# EAGLE design main (EAGLE 9.6.2)
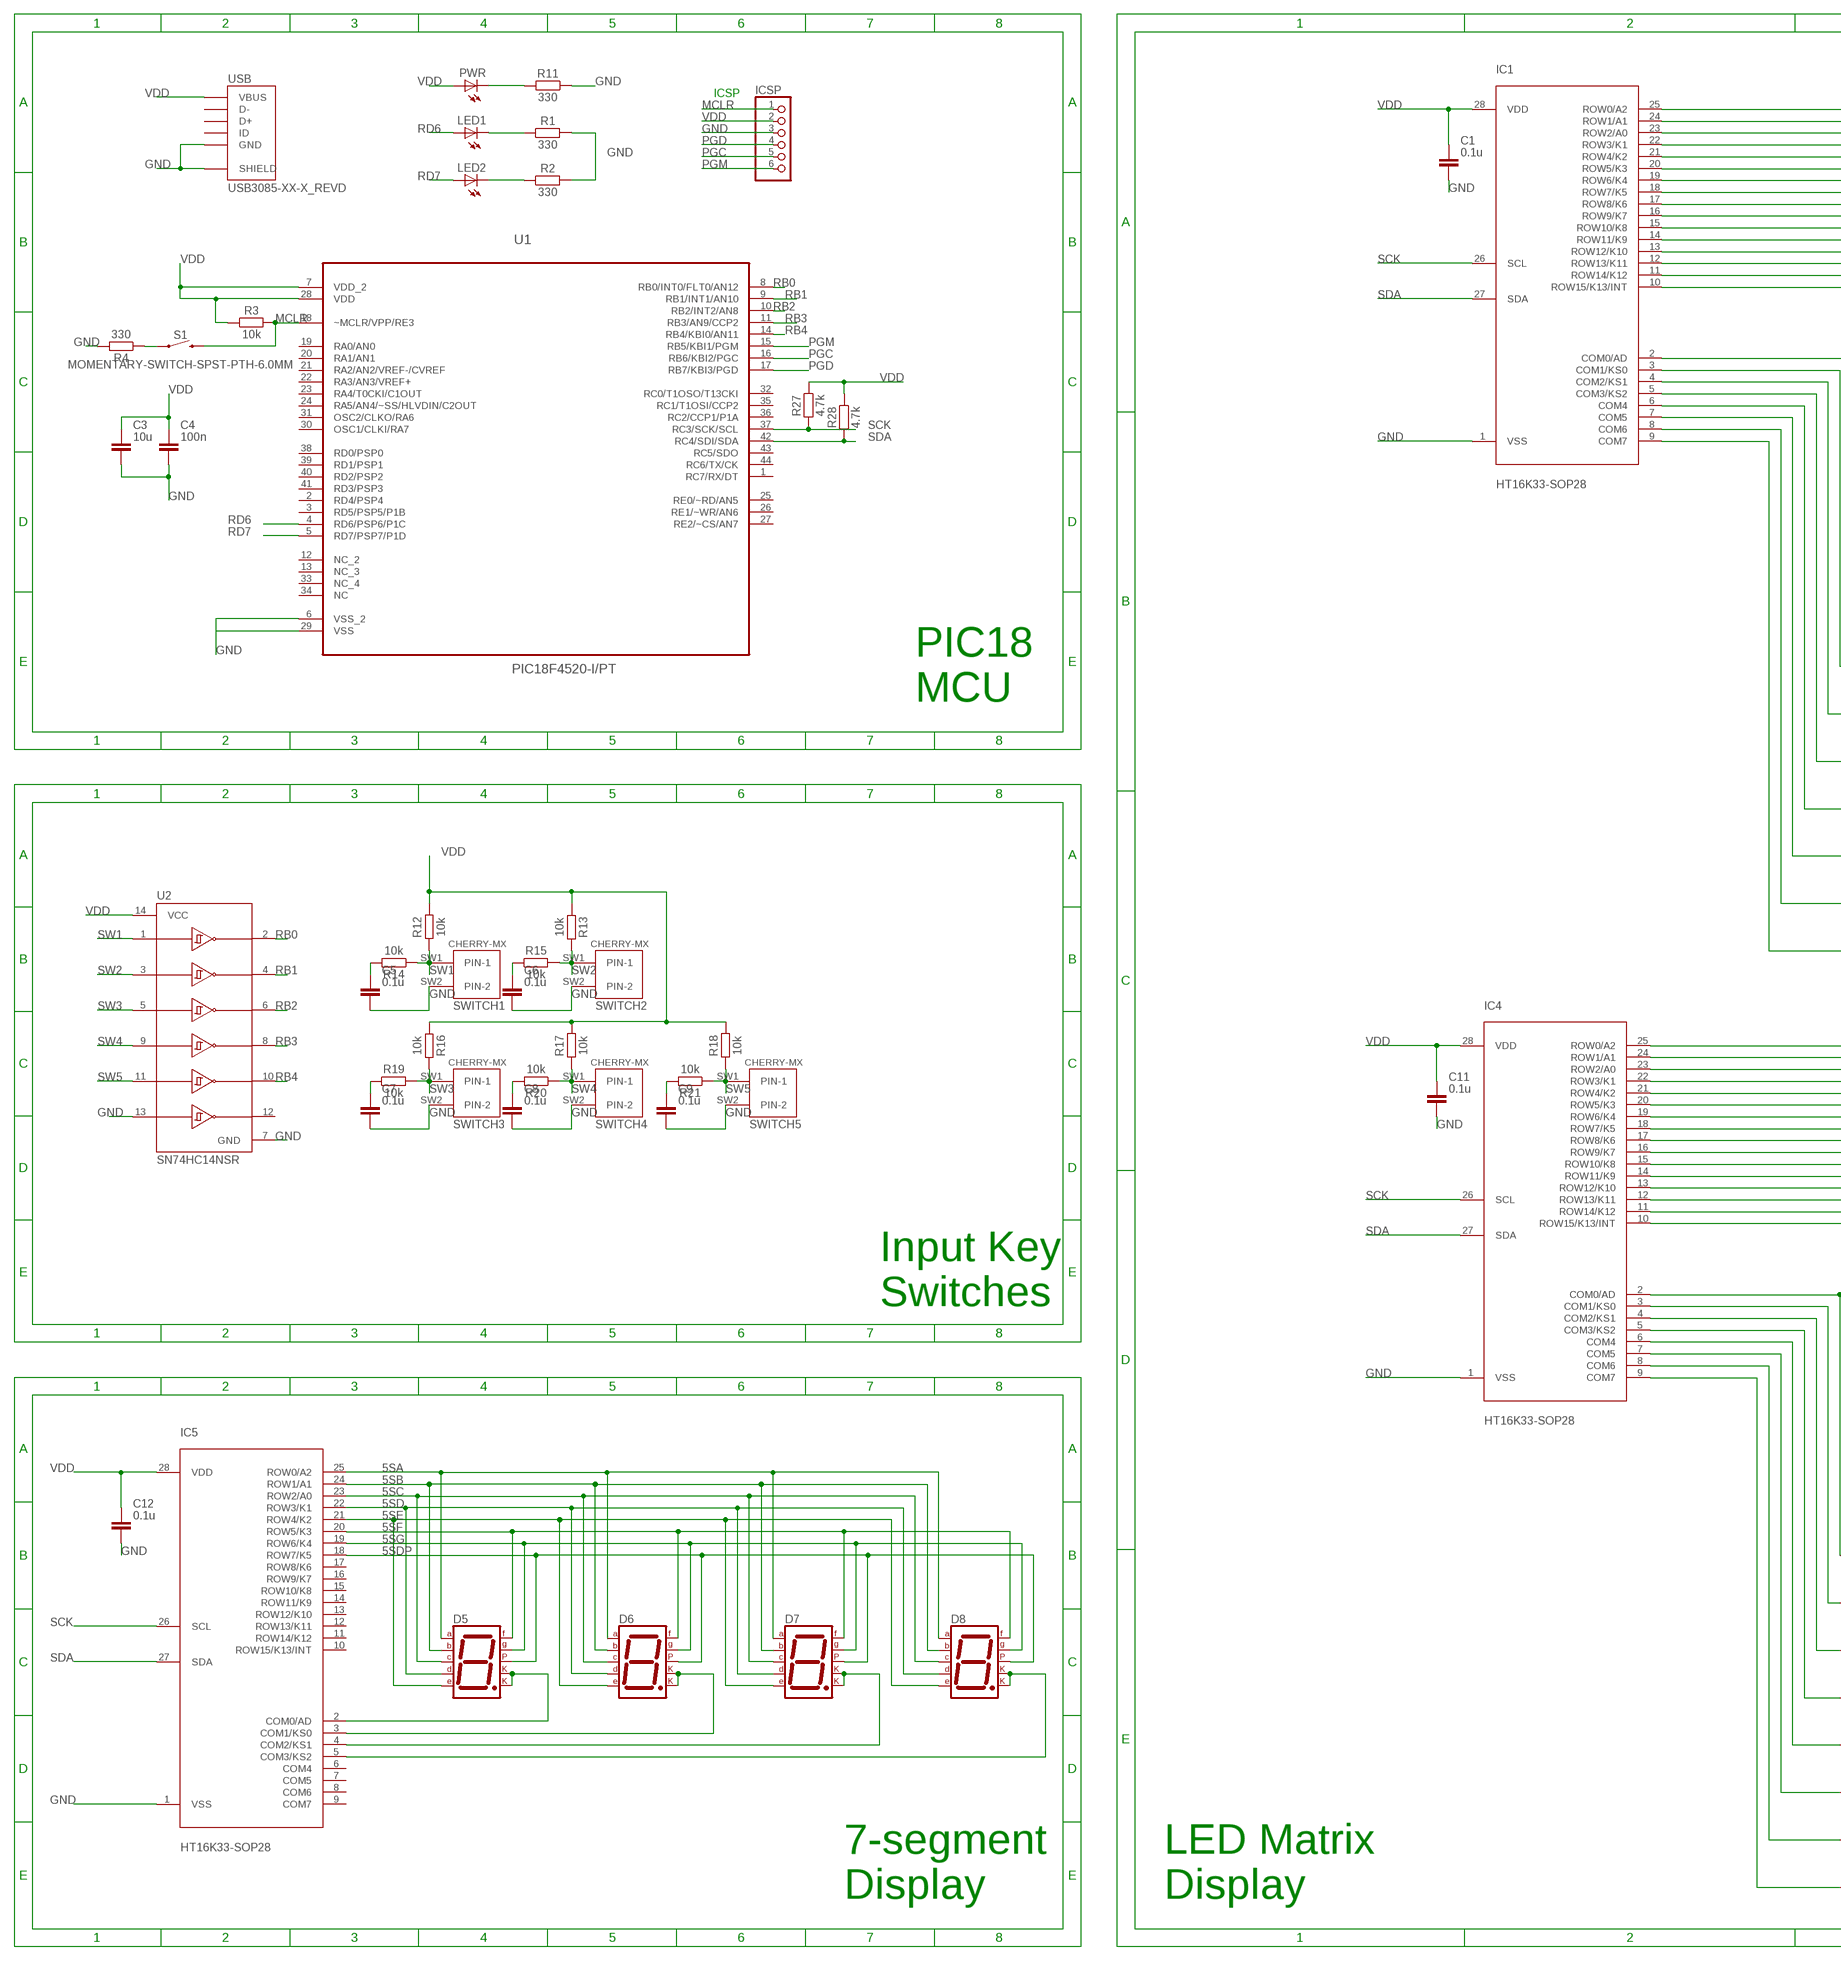
[diagram p0: schematic, sheet 1, part 1 of 2]
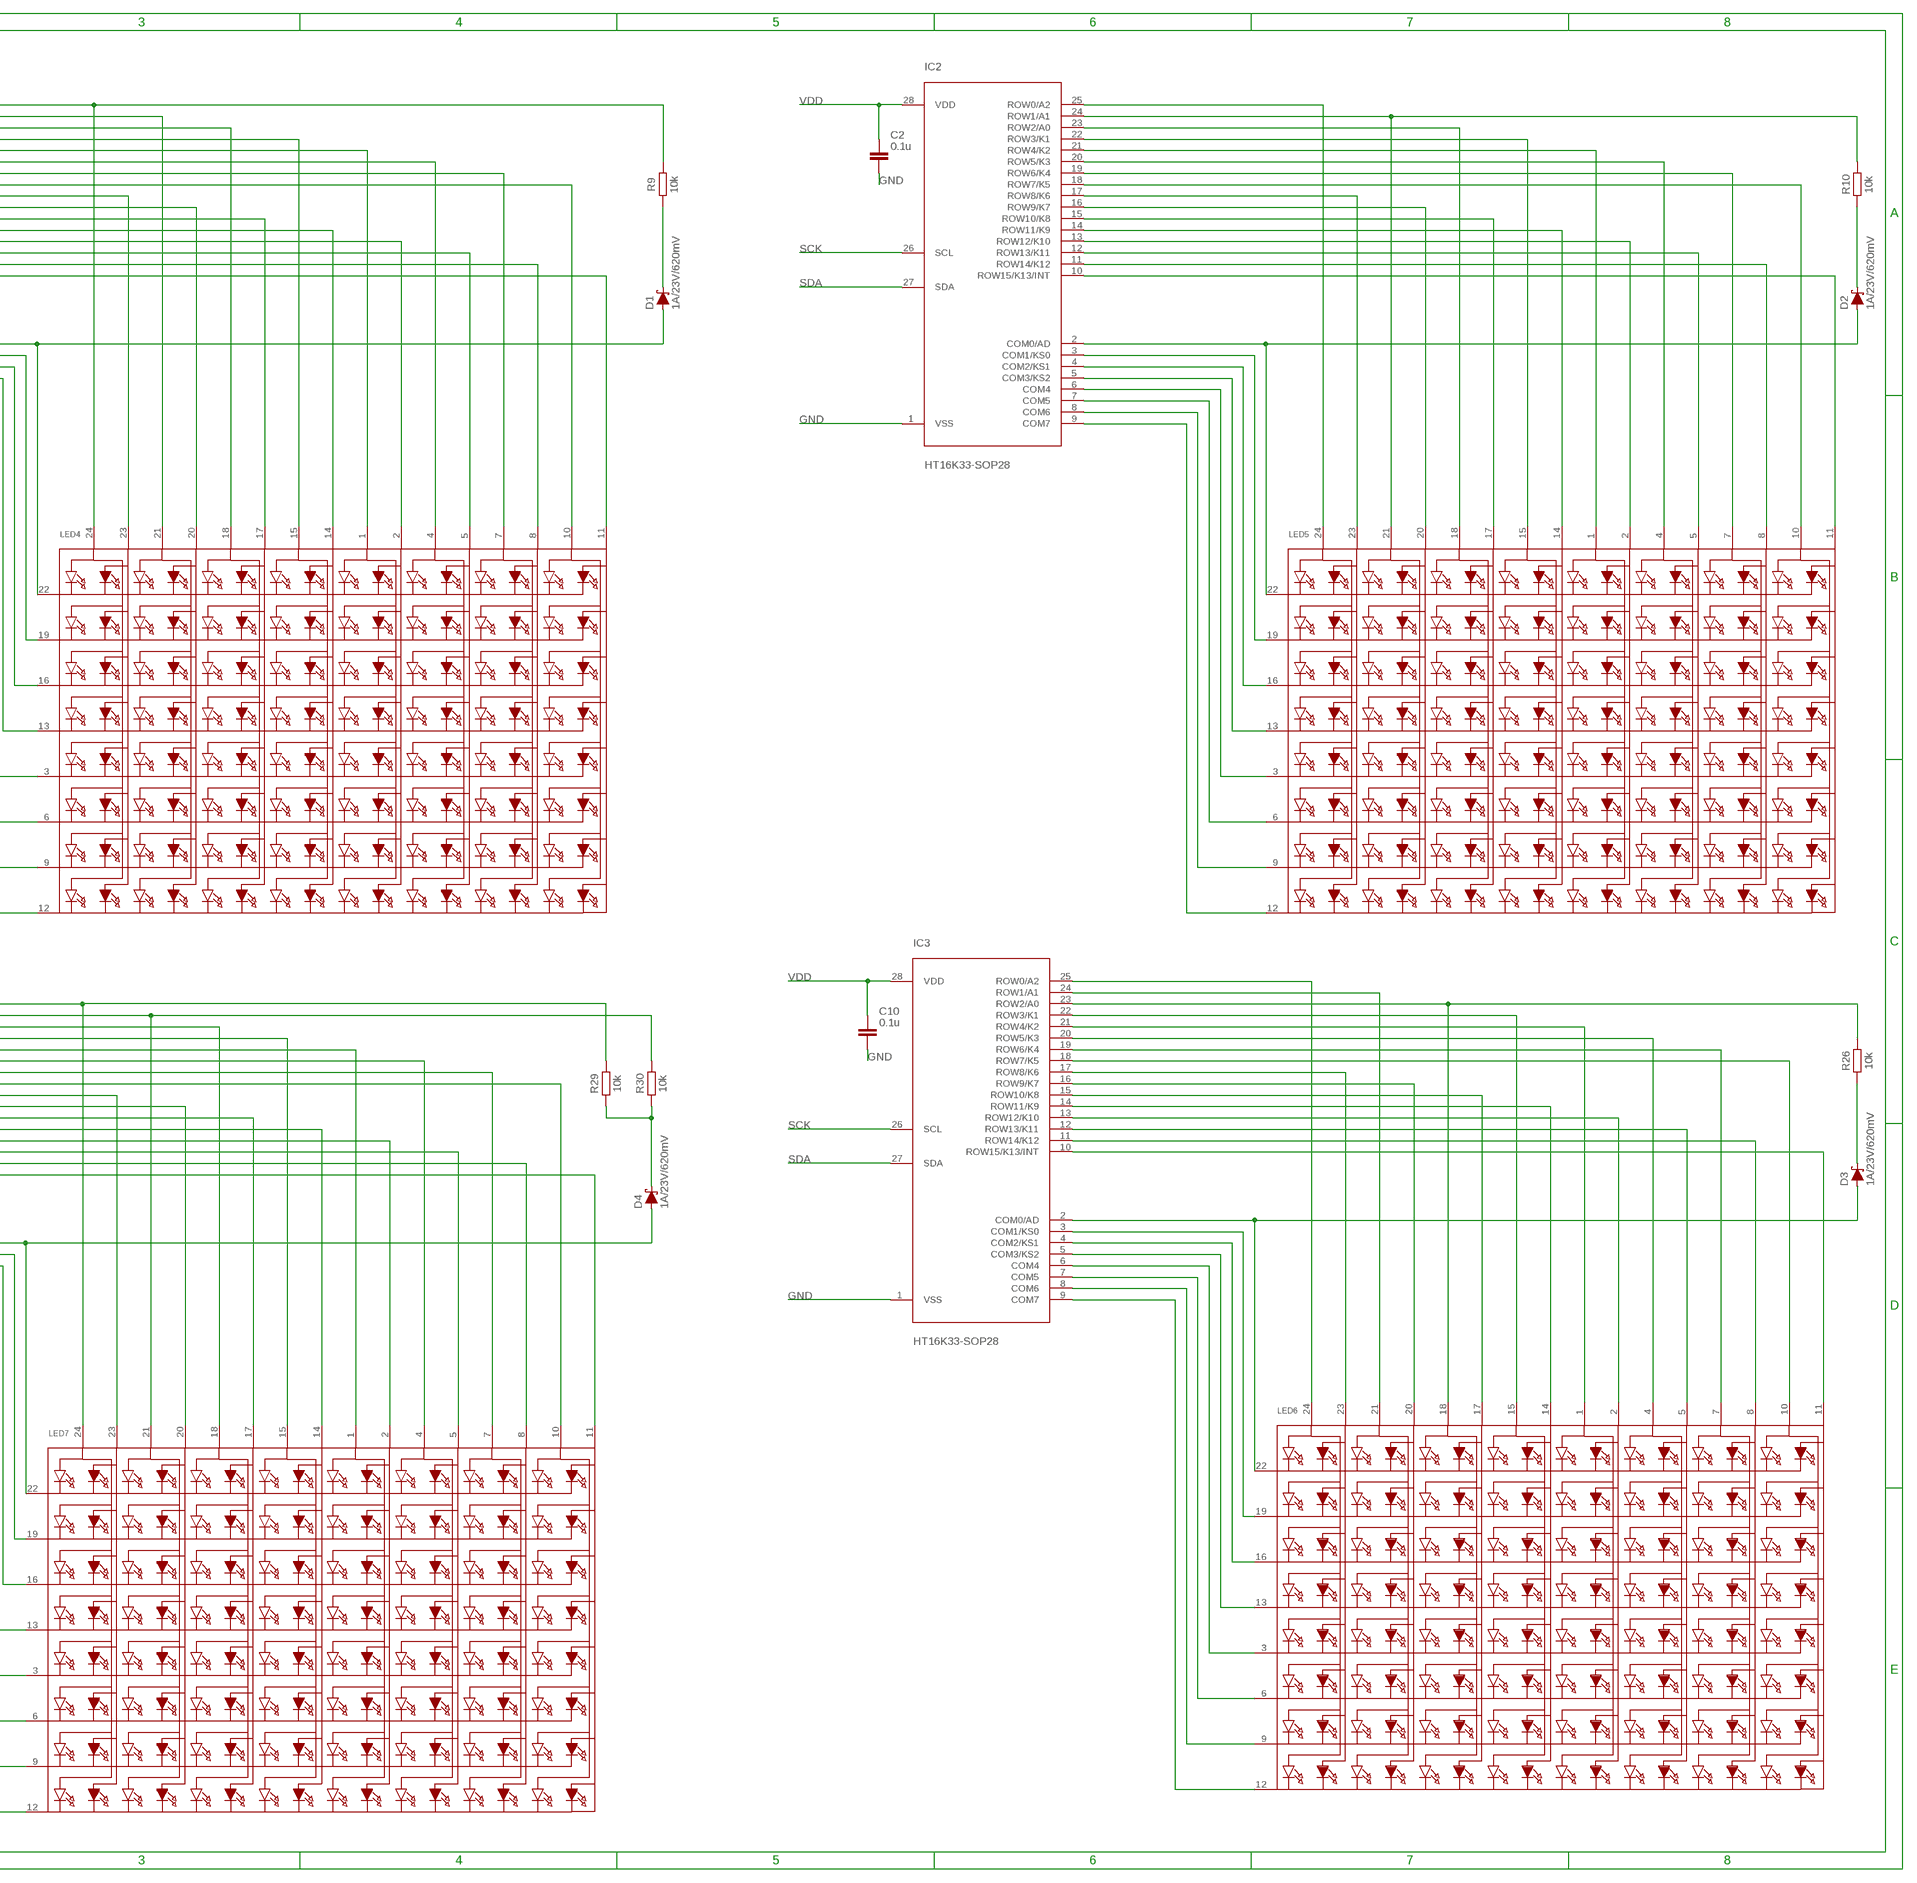
[diagram p1: schematic, sheet 1, part 2 of 2]

## Parts
C1  0.1u  C_CHIP-0805(2012-METRIC)  [CAPC2012X110]
C2  0.1u  C_CHIP-0805(2012-METRIC)  [CAPC2012X110]
C3  10u  C_CHIP-0805(2012-METRIC)  [CAPC2012X110]
C4  100n  C_CHIP-0805(2012-METRIC)  [CAPC2012X110]
C5  0.1u  C_CHIP-0805(2012-METRIC)  [CAPC2012X110]
C6  0.1u  C_CHIP-0805(2012-METRIC)  [CAPC2012X110]
C7  0.1u  C_CHIP-0805(2012-METRIC)  [CAPC2012X110]
C8  0.1u  C_CHIP-0805(2012-METRIC)  [CAPC2012X110]
C9  0.1u  C_CHIP-0805(2012-METRIC)  [CAPC2012X110]
C10  0.1u  C_CHIP-0805(2012-METRIC)  [CAPC2012X110]
C11  0.1u  C_CHIP-0805(2012-METRIC)  [CAPC2012X110]
C12  0.1u  C_CHIP-0805(2012-METRIC)  [CAPC2012X110]
D1  1A/23V/620mV  DIODE-SCHOTTKY-BAT20J  [SOD-323]
D2  1A/23V/620mV  DIODE-SCHOTTKY-BAT20J  [SOD-323]
D3  1A/23V/620mV  DIODE-SCHOTTKY-BAT20J  [SOD-323]
D4  1A/23V/620mV  DIODE-SCHOTTKY-BAT20J  [SOD-323]
D5  7SEG-CK  [7SEG-13]
D6  7SEG-CK  [7SEG-13]
D7  7SEG-CK  [7SEG-13]
D8  7SEG-CK  [7SEG-13]
IC1  HT16K33-SOP28  [SOIC127P1031X264-28N]
IC2  HT16K33-SOP28  [SOIC127P1031X264-28N]
IC3  HT16K33-SOP28  [SOIC127P1031X264-28N]
IC4  HT16K33-SOP28  [SOIC127P1031X264-28N]
IC5  HT16K33-SOP28  [SOIC127P1031X264-28N]
ICSP  PINHD-1X6  [1X06]
LED1  LEDCHIPLED_0805  [CHIPLED_0805]
LED2  LEDCHIPLED_0805  [CHIPLED_0805]
LED4  SEGMENT_8X8_BICOLOR_ROWCATHODEMI2A883XX  [SEGMENT_BICOL_BL-M12A883XX]
LED5  SEGMENT_8X8_BICOLOR_ROWCATHODEMI2A883XX  [SEGMENT_BICOL_BL-M12A883XX]
LED6  SEGMENT_8X8_BICOLOR_ROWCATHODEMI2A883XX  [SEGMENT_BICOL_BL-M12A883XX]
LED7  SEGMENT_8X8_BICOLOR_ROWCATHODEMI2A883XX  [SEGMENT_BICOL_BL-M12A883XX]
PWR  LEDCHIPLED_0805  [CHIPLED_0805]
R1  330  R_CHIP-0805(2012-METRIC)  [RESC2012X65]
R2  330  R_CHIP-0805(2012-METRIC)  [RESC2012X65]
R3  10k  R_CHIP-0805(2012-METRIC)  [RESC2012X65]
R4  330  R_CHIP-0805(2012-METRIC)  [RESC2012X65]
R9  10k  R_CHIP-0805(2012-METRIC)  [RESC2012X65]
R10  10k  R_CHIP-0805(2012-METRIC)  [RESC2012X65]
R11  330  R_CHIP-0805(2012-METRIC)  [RESC2012X65]
R12  10k  R_CHIP-0805(2012-METRIC)  [RESC2012X65]
R13  10k  R_CHIP-0805(2012-METRIC)  [RESC2012X65]
R14  10k  R_CHIP-0805(2012-METRIC)  [RESC2012X65]
R15  10k  R_CHIP-0805(2012-METRIC)  [RESC2012X65]
R16  10k  R_CHIP-0805(2012-METRIC)  [RESC2012X65]
R17  10k  R_CHIP-0805(2012-METRIC)  [RESC2012X65]
R18  10k  R_CHIP-0805(2012-METRIC)  [RESC2012X65]
R19  10k  R_CHIP-0805(2012-METRIC)  [RESC2012X65]
R20  10k  R_CHIP-0805(2012-METRIC)  [RESC2012X65]
R21  10k  R_CHIP-0805(2012-METRIC)  [RESC2012X65]
R26  10k  R_CHIP-0805(2012-METRIC)  [RESC2012X65]
R27  4.7k  R_CHIP-0805(2012-METRIC)  [RESC2012X65]
R28  4.7k  R_CHIP-0805(2012-METRIC)  [RESC2012X65]
R29  10k  R_CHIP-0805(2012-METRIC)  [RESC2012X65]
R30  10k  R_CHIP-0805(2012-METRIC)  [RESC2012X65]
S1  MOMENTARY-SWITCH-SPST-PTH-6.0MM  [TACTILE_SWITCH_PTH_6.0MM]
SWITCH1  CHERRY-MX  [CHERRY-MX]
SWITCH2  CHERRY-MX  [CHERRY-MX]
SWITCH3  CHERRY-MX  [CHERRY-MX]
SWITCH4  CHERRY-MX  [CHERRY-MX]
SWITCH5  CHERRY-MX  [CHERRY-MX]
U1  PIC18F4520-I/PT  [QFP80P1200X1200X120-44N]
U2  SN74HC14NSR  [SOP127P780X200-14N]
USB  USB3085-XX-X_REVD  [GCT_USB3085-XX-X_REVD]

## Nets
5D2: D7.3(CK1) D7.8(CK2) IC5.4(COM2/KS1)
5D3: D8.3(CK1) D8.8(CK2) IC5.5(COM3/KS2)
5SA: D5.7(A) D6.7(A) D7.7(A) D8.7(A) IC5.25(ROW0/A2)
5SB: D5.6(B) D6.6(B) D7.6(B) D8.6(B) IC5.24(ROW1/A1)
5SC: D5.4(C) D6.4(C) D7.4(C) D8.4(C) IC5.23(ROW2/A0)
5SD: D5.2(D) D6.2(D) D7.2(D) D8.2(D) IC5.22(ROW3/K1)
5SDP: D5.5(DP) D6.5(DP) D7.5(DP) D8.5(DP) IC5.18(ROW7/K5)
5SE: D5.1(E) D6.1(E) D7.1(E) D8.1(E) IC5.21(ROW4/K2)
5SF: D5.9(F) D6.9(F) D7.9(F) D8.9(F) IC5.20(ROW5/K3)
5SG: D5.10(G) D6.10(G) D7.10(G) D8.10(G) IC5.19(ROW6/K4)
GND: C1.2 C2.2 C3.2 C4.2 C5.2 C6.2 C7.2 C8.2 C9.2 C10.2 C11.2 C12.2 IC1.1(VSS) IC2.1(VSS) IC3.1(VSS) IC4.1(VSS) IC5.1(VSS) ICSP.3 R1.2 R2.2 R4.2 R11.1 SWITCH1.SW2(PIN-2) SWITCH2.SW2(PIN-2) SWITCH3.SW2(PIN-2) SWITCH4.SW2(PIN-2) SWITCH5.SW2(PIN-2) U1.6(VSS_2) U1.29(VSS) U2.7(GND) U2.13(6A) USB.5(GND) USB.6(SHIELD) USB.7(SHIELD) USB.8(SHIELD) USB.9(SHIELD)
MCLR: ICSP.1 R3.2 S1.3 U1.18(~MCLR/VPP/RE3)
N$3: IC1.25(ROW0/A2) LED4.24(A1) R9.2
N$4: IC1.24(ROW1/A1) LED4.21(A3)
N$5: R4.1 S1.1
N$6: IC1.23(ROW2/A0) LED4.18(A5)
N$7: IC1.22(ROW3/K1) LED4.15(A7)
N$8: IC1.21(ROW4/K2) LED4.1(A9)
N$9: IC1.20(ROW5/K3) LED4.4(A11)
N$10: IC1.19(ROW6/K4) LED4.7(A13)
N$11: IC1.18(ROW7/K5) LED4.10(A15)
N$12: IC1.17(ROW8/K6) LED4.23(A2)
N$13: IC1.16(ROW9/K7) LED4.20(A4)
N$14: IC1.15(ROW10/K8) LED4.17(A6)
N$15: IC1.14(ROW11/K9) LED4.14(A8)
N$16: IC1.13(ROW12/K10) LED4.2(A10)
N$17: IC1.12(ROW13/K11) LED4.5(A12)
N$18: IC1.11(ROW14/K12) LED4.8(A14)
N$19: IC1.10(ROW15/K13/INT) LED4.11(A16)
N$20: D1.A IC1.2(COM0/AD) LED4.22(K1)
N$21: IC1.3(COM1/KS0) LED4.19(K2)
N$22: IC1.4(COM2/KS1) LED4.16(K3)
N$23: IC1.5(COM3/KS2) LED4.13(K4)
N$24: IC1.6(COM4) LED4.3(K5)
N$25: IC1.7(COM5) LED4.6(K6)
N$26: IC1.8(COM6) LED4.9(K7)
N$27: IC1.9(COM7) LED4.12(K8)
N$28: D1.C R9.1
N$29: C9.1 R21.2
N$34: IC2.25(ROW0/A2) LED5.24(A1)
N$35: IC2.24(ROW1/A1) LED5.21(A3) R10.2
N$36: IC2.23(ROW2/A0) LED5.18(A5)
N$37: IC2.22(ROW3/K1) LED5.15(A7)
N$38: IC2.21(ROW4/K2) LED5.1(A9)
N$39: IC2.20(ROW5/K3) LED5.4(A11)
N$40: IC2.19(ROW6/K4) LED5.7(A13)
N$41: IC2.18(ROW7/K5) LED5.10(A15)
N$42: IC2.17(ROW8/K6) LED5.23(A2)
N$43: IC2.16(ROW9/K7) LED5.20(A4)
N$44: IC2.15(ROW10/K8) LED5.17(A6)
N$45: IC2.14(ROW11/K9) LED5.14(A8)
N$46: IC2.13(ROW12/K10) LED5.2(A10)
N$47: IC2.12(ROW13/K11) LED5.5(A12)
N$48: IC2.11(ROW14/K12) LED5.8(A14)
N$49: IC2.10(ROW15/K13/INT) LED5.11(A16)
N$50: D2.A IC2.2(COM0/AD) LED5.22(K1)
N$51: IC2.3(COM1/KS0) LED5.19(K2)
N$52: IC2.4(COM2/KS1) LED5.16(K3)
N$53: LED1.C R1.1
N$54: PWR.C R11.2
N$55: IC2.5(COM3/KS2) LED5.13(K4)
N$56: IC2.6(COM4) LED5.3(K5)
N$57: IC2.7(COM5) LED5.6(K6)
N$58: IC2.8(COM6) LED5.9(K7)
N$59: LED2.C R2.1
N$60: C5.1 R14.2
N$61: C6.1 R15.1
N$62: C8.1 R20.2
N$63: C7.1 R19.1
N$64: IC2.9(COM7) LED5.12(K8)
N$67: D2.C R10.1
N$72: IC4.24(ROW1/A1) LED7.21(A3) R30.2
N$73: IC4.23(ROW2/A0) LED7.18(A5)
N$74: IC4.22(ROW3/K1) LED7.15(A7)
N$75: IC4.21(ROW4/K2) LED7.1(A9)
N$76: IC4.20(ROW5/K3) LED7.4(A11)
N$77: IC4.19(ROW6/K4) LED7.7(A13)
N$78: IC4.18(ROW7/K5) LED7.10(A15)
N$79: IC4.17(ROW8/K6) LED7.23(A2)
N$80: IC4.16(ROW9/K7) LED7.20(A4)
N$81: IC4.15(ROW10/K8) LED7.17(A6)
N$82: IC4.14(ROW11/K9) LED7.14(A8)
N$83: IC4.13(ROW12/K10) LED7.2(A10)
N$84: IC4.12(ROW13/K11) LED7.5(A12)
N$85: IC4.11(ROW14/K12) LED7.8(A14)
N$86: IC4.10(ROW15/K13/INT) LED7.11(A16)
N$87: D4.A IC4.2(COM0/AD) LED7.22(K1)
N$88: IC4.3(COM1/KS0) LED7.19(K2)
N$89: IC4.4(COM2/KS1) LED7.16(K3)
N$90: IC4.5(COM3/KS2) LED7.13(K4)
N$91: IC4.6(COM4) LED7.3(K5)
N$92: IC4.7(COM5) LED7.6(K6)
N$93: IC4.8(COM6) LED7.9(K7)
N$94: IC4.9(COM7) LED7.12(K8)
N$97: D4.C R29.1 R30.1
N$98: IC4.25(ROW0/A2) LED7.24(A1) R29.2
N$101: IC3.25(ROW0/A2) LED6.24(A1)
N$102: IC3.24(ROW1/A1) LED6.21(A3)
N$103: IC3.23(ROW2/A0) LED6.18(A5) R26.2
N$104: IC3.22(ROW3/K1) LED6.15(A7)
N$105: IC3.21(ROW4/K2) LED6.1(A9)
N$106: IC3.20(ROW5/K3) LED6.4(A11)
N$107: IC3.19(ROW6/K4) LED6.7(A13)
N$108: IC3.18(ROW7/K5) LED6.10(A15)
N$109: IC3.17(ROW8/K6) LED6.23(A2)
N$110: IC3.16(ROW9/K7) LED6.20(A4)
N$111: IC3.15(ROW10/K8) LED6.17(A6)
N$112: IC3.14(ROW11/K9) LED6.14(A8)
N$113: IC3.13(ROW12/K10) LED6.2(A10)
N$114: IC3.12(ROW13/K11) LED6.5(A12)
N$115: IC3.11(ROW14/K12) LED6.8(A14)
N$116: IC3.10(ROW15/K13/INT) LED6.11(A16)
N$117: D3.A IC3.2(COM0/AD) LED6.22(K1)
N$118: IC3.3(COM1/KS0) LED6.19(K2)
N$119: IC3.4(COM2/KS1) LED6.16(K3)
N$120: IC3.5(COM3/KS2) LED6.13(K4)
N$121: IC3.6(COM4) LED6.3(K5)
N$122: IC3.7(COM5) LED6.6(K6)
N$123: IC3.8(COM6) LED6.9(K7)
N$124: IC3.9(COM7) LED6.12(K8)
N$127: D3.C R26.1
N$131: D5.3(CK1) D5.8(CK2) IC5.2(COM0/AD)
N$132: D6.3(CK1) D6.8(CK2) IC5.3(COM1/KS0)
PGC: ICSP.5 U1.16(RB6/KBI2/PGC)
PGD: ICSP.4 U1.17(RB7/KBI3/PGD)
PGM: ICSP.6 U1.15(RB5/KBI1/PGM)
RB0: U1.8(RB0/INT0/FLT0/AN12) U2.2(1Y)
RB1: U1.9(RB1/INT1/AN10) U2.4(2Y)
RB2: U1.10(RB2/INT2/AN8) U2.6(3Y)
RB3: U1.11(RB3/AN9/CCP2) U2.8(4Y)
RB4: U1.14(RB4/KBI0/AN11) U2.10(5Y)
RD6: LED1.A U1.4(RD6/PSP6/P1C)
RD7: LED2.A U1.5(RD7/PSP7/P1D)
SCK: IC1.26(SCL) IC2.26(SCL) IC3.26(SCL) IC4.26(SCL) IC5.26(SCL) R27.2 U1.37(RC3/SCK/SCL)
SDA: IC1.27(SDA) IC2.27(SDA) IC3.27(SDA) IC4.27(SDA) IC5.27(SDA) R28.2 U1.42(RC4/SDI/SDA)
SW1: R12.1 R14.1 SWITCH1.SW1(PIN-1) U2.1(1A)
SW2: R13.2 R15.2 SWITCH2.SW1(PIN-1) U2.3(2A)
SW3: R16.2 R19.2 SWITCH3.SW1(PIN-1) U2.5(3A)
SW4: R17.1 R20.1 SWITCH4.SW1(PIN-1) U2.9(4A)
SW5: R18.1 R21.1 SWITCH5.SW1(PIN-1) U2.11(5A)
VDD: C1.1 C2.1 C3.1 C4.1 C10.1 C11.1 C12.1 IC1.28(VDD) IC2.28(VDD) IC3.28(VDD) IC4.28(VDD) IC5.28(VDD) ICSP.2 PWR.A R3.1 R12.2 R13.1 R16.1 R17.2 R18.2 R27.1 R28.1 U1.7(VDD_2) U1.28(VDD) U2.14(VCC) USB.1(VBUS)
Unconnected: IC5.6(COM4) IC5.7(COM5) IC5.8(COM6) IC5.9(COM7) IC5.10(ROW15/K13/INT) IC5.11(ROW14/K12) IC5.12(ROW13/K11) IC5.13(ROW12/K10) IC5.14(ROW11/K9) IC5.15(ROW10/K8) IC5.16(ROW9/K7) IC5.17(ROW8/K6) U1.1(RC7/RX/DT) U1.2(RD4/PSP4) U1.3(RD5/PSP5/P1B) U1.12(NC_2) U1.13(NC_3) U1.19(RA0/AN0) U1.20(RA1/AN1) U1.21(RA2/AN2/VREF-/CVREF) U1.22(RA3/AN3/VREF+) U1.23(RA4/T0CKI/C1OUT) U1.24(RA5/AN4/~SS/HLVDIN/C2OUT) U1.25(RE0/~RD/AN5) U1.26(RE1/~WR/AN6) U1.27(RE2/~CS/AN7) U1.30(OSC1/CLKI/RA7) U1.31(OSC2/CLKO/RA6) U1.32(RC0/T1OSO/T13CKI) U1.33(NC_4) U1.34(NC) U1.35(RC1/T1OSI/CCP2) U1.36(RC2/CCP1/P1A) U1.38(RD0/PSP0) U1.39(RD1/PSP1) U1.40(RD2/PSP2) U1.41(RD3/PSP3) U1.43(RC5/SDO) U1.44(RC6/TX/CK) U2.12(6Y) USB.2(D-) USB.3(D+) USB.4(ID)

## Notes on the sheet
- ICSP
- PIC18
  MCU
- Input Key
  Switches
- 7-segment
  Display
- LED Matrix
  Display

## Library data of the parts
C1-C12 = Capacitor:C: Capacitor - Generic; CATEGORY: Capacitor
D1-D4 = SparkFun-DiscreteSemi:DIODE-SCHOTTKY: Schottky diode A Schottky diode is a semiconductor diode which has a low forward voltage drop and a very fast switching action.; PROD_ID: DIO-11623
D5-D8 = special:7SEG-CK: 7-segment DISPLAY single cathode, 13 mm
IC1-IC5 = holtek-led-controller-v1:HT16K33-SOP28: RAM Mapping 16*8 LED Controller Driver with keyscan
ICSP = adafruit:PINHD-1X6: PIN HEADER
LED1 LED2 PWR = adafruit:LED: LED OSRAM: - CHIPLED LG R971, LG N971, LY N971, LG Q971, LY Q971, LO R971, LY R971 LH N974, LH R974 LS Q976, LO Q976, LY Q976 LO Q996 - Hyper CHIPLED LW Q18S LB Q993, LB Q99A, LB R99A - SideLED LS A670, LO A670, LY A670, LG A670, LP A670 LB A673, LV A673, LT A673, LW A673 LH A674 LY A675 LS A676, LA A676, LO A676, LY A676, LW A676 LS A679, LY A679, LG A679 - Hyper Micro SIDELED® LS Y876, LA Y876, LO Y876, LY Y876 LT Y87S - SmartLED LW L88C, LW L88S LB L89C, LB L89S, LG L890 LS L89K, LO L89K, LY L89K LS L896, LA L896, LO L896, LY L896 - TOPLED LS T670, LO T670, LY T670, LG T670, LP T670 LSG T670, LSP T670, LSY T670, LOP T670, LYG T670 LG T671, LOG T671, LSG T671 LB T673, LV T673, LT T673, LW T673 LH T674 LS T676, LA T676, LO T676, LY T676, LB T676, LH T676, LSB T676, LW T676 LB T67C, LV T67C, LT T67C, LS T67K, LO T67K, LY T67K, LW E67C LS E67B, LA E67B, LO E67B, LY E67B, LB E67C, LV E67C, LT E67C LW T67C LS T679, LY T679, LG T679 LS T770, LO T770, LY T770, LG T770, LP T770 LB T773, LV T773, LT T773, LW T773 LH T774 LS E675, LA E675, LY E675, LS T675 LS T776, LA T776, LO T776, LY T776, LB T776 LHGB T686 LT T68C, LB T68C - Hyper Mini TOPLED® LB M676 - Mini TOPLED Santana® LG M470 LS M47K, LO M47K, LY M47K Source: http://www.osram.convergy.de/
LED4-LED7 = adafruit:SEGMENT_8X8_BICOLOR_ROWCATHODE: 8x8 Bi-Color LED Segment Displays: Row = Cathode 1.2" Bi-Color 8x8 Matrix, 3.0mm Square LEDs - BL-M12A883XX
R1-R4 R9-R21 R26-R30 = Resistor:R: Resistor Fixed - Generic; CATEGORY: Resistor; SUB-CATEGORY: Fixed
S1 = SparkFun-Switches:MOMENTARY-SWITCH-SPST: Momentary Switch (Pushbutton) - SPST Normally-open (NO) SPST momentary switches (buttons, pushbuttons). Variants PTH-12MM - 12mm square, through-hole Momentary Pushbutton Switch - 12mm Square <https://www.sparkfun.com/products/9190> (COM-09190) PTH-6.0MM, PTH-6.0MM-KIT - 6.0mm square, through-hole Mini Pushbutton Switch <https://www.sparkfun.com/products/97> (COM-00097) KIT package intended for soldering kit's - only one side of pads' copper is exposed. PTH-RIGHT-ANGLE-KIT - Right-angle, through-hole Right Angle Tactile Button <https://www.sparkfun.com/products/10791> - Used on SparkFun BigTime Watch Kit <https://www.sparkfun.com/products/11734> SMD-12MM - 12mm square, surface-mount Tactile Button - SMD (12mm) <https://www.sparkfun.com/products/12993> (COM-12993) Used on SparkFun PicoBoard <https://www.sparkfun.com/products/11888> SMD-4.5MM - 4.5mm Square Trackball Switch Used on SparkFun Blackberry Trackballer Breakout <https://www.sparkfun.com/products/13169> SMD-4.6MMX2.8MM - 4.60mm x 2.80mm, surface mount Used on SparkFun SAMD21 Mini Breakout <https://www.sparkfun.com/products/13664> SMD-5.2MM, SMD-5.2-REDUNDANT - 5.2mm square, surface-mount Mini Pushbutton Switch - SMD <https://www.sparkfun.com/products/8720> (COM-08720) Used on Arduino Pro Mini <https://www.sparkfun.com/products/11114> REDUNDANT package connects both switch circuits together SMD-6.0X3.5MM - 6.0 x 3.5mm, surface mount Momentary Reset Switch SMD <https://www.sparkfun.com/products/8229> (COM-08229) SMD-6.2MM-TALL - 6.2mm square, surface mount Tactile Button - SMD (6mm) <https://www.sparkfun.com/products/12992> Used on SparkFun Digital Sandbox <https://www.sparkfun.com/products/12651> SMD-RIGHT-ANGLE - Right-angle, surface mount Used on SparkFun Block for Intel® Edison - Arduino <https://www.sparkfun.com/products/13036>; PROD_ID: SWCH-08441; SF_SKU: COM-00097
SWITCH1-SWITCH5 = cherrymx:CHERRY-MX: Cherry MX series keyswitch
U1 = PIC18F4520-I_PT:PIC18F4520-I/PT: Flash Microcontrollers Check prices <https://pricing.snapeda.com/parts/PIC18F4520-I/PT/Microchip/view-part?ref=eda>; AVAILABILITY: Good; DESCRIPTION: PIC PIC® 18F Microcontroller IC 8-Bit 40MHz 32KB (16K x 16) FLASH 44-TQFP (10x10); MF: Microchip; MP: PIC18F4520-I/PT; PACKAGE: TQFP-44 Microchip; PRICE: None; PURCHASE-URL: https://pricing.snapeda.com/search/part/PIC18F4520-I/PT/?ref=eda
U2 = SN74HC14NSR:SN74HC14NSR: Check prices <https://pricing.snapeda.com/parts/SN74HC14NSR/Texas%20Instruments/view-part?ref=eda>; AVAILABILITY: Good; DESCRIPTION: Hex Schmitt-Trigger Inverters 14-SO -40 to 85; MF: Texas Instruments; MP: SN74HC14NSR; PACKAGE: SOP-14 Texas Instruments; PRICE: None; PURCHASE-URL: https://pricing.snapeda.com/search/part/SN74HC14NSR/?ref=eda
USB = USB3085-XX-X_REVD:USB3085-XX-X_REVD: Micro USB Receptacle, Type AB, Surface Mount, Horizontak, Bottom Mount, Without Peg Check prices <https://pricing.snapeda.com/parts/USB3085-30-A/Global%20Connector%20Technology/view-part?ref=eda>; AVAILABILITY: Warning; DESCRIPTION: USB - micro AB USB 2.0 Receptacle Connector 5 Position Surface Mount, Right Angle; MF: Global Connector Technology; MP: USB3085-30-A; PACKAGE: None; PRICE: None; PURCHASE-URL: https://pricing.snapeda.com/search/part/USB3085-30-A/?ref=eda

## Board
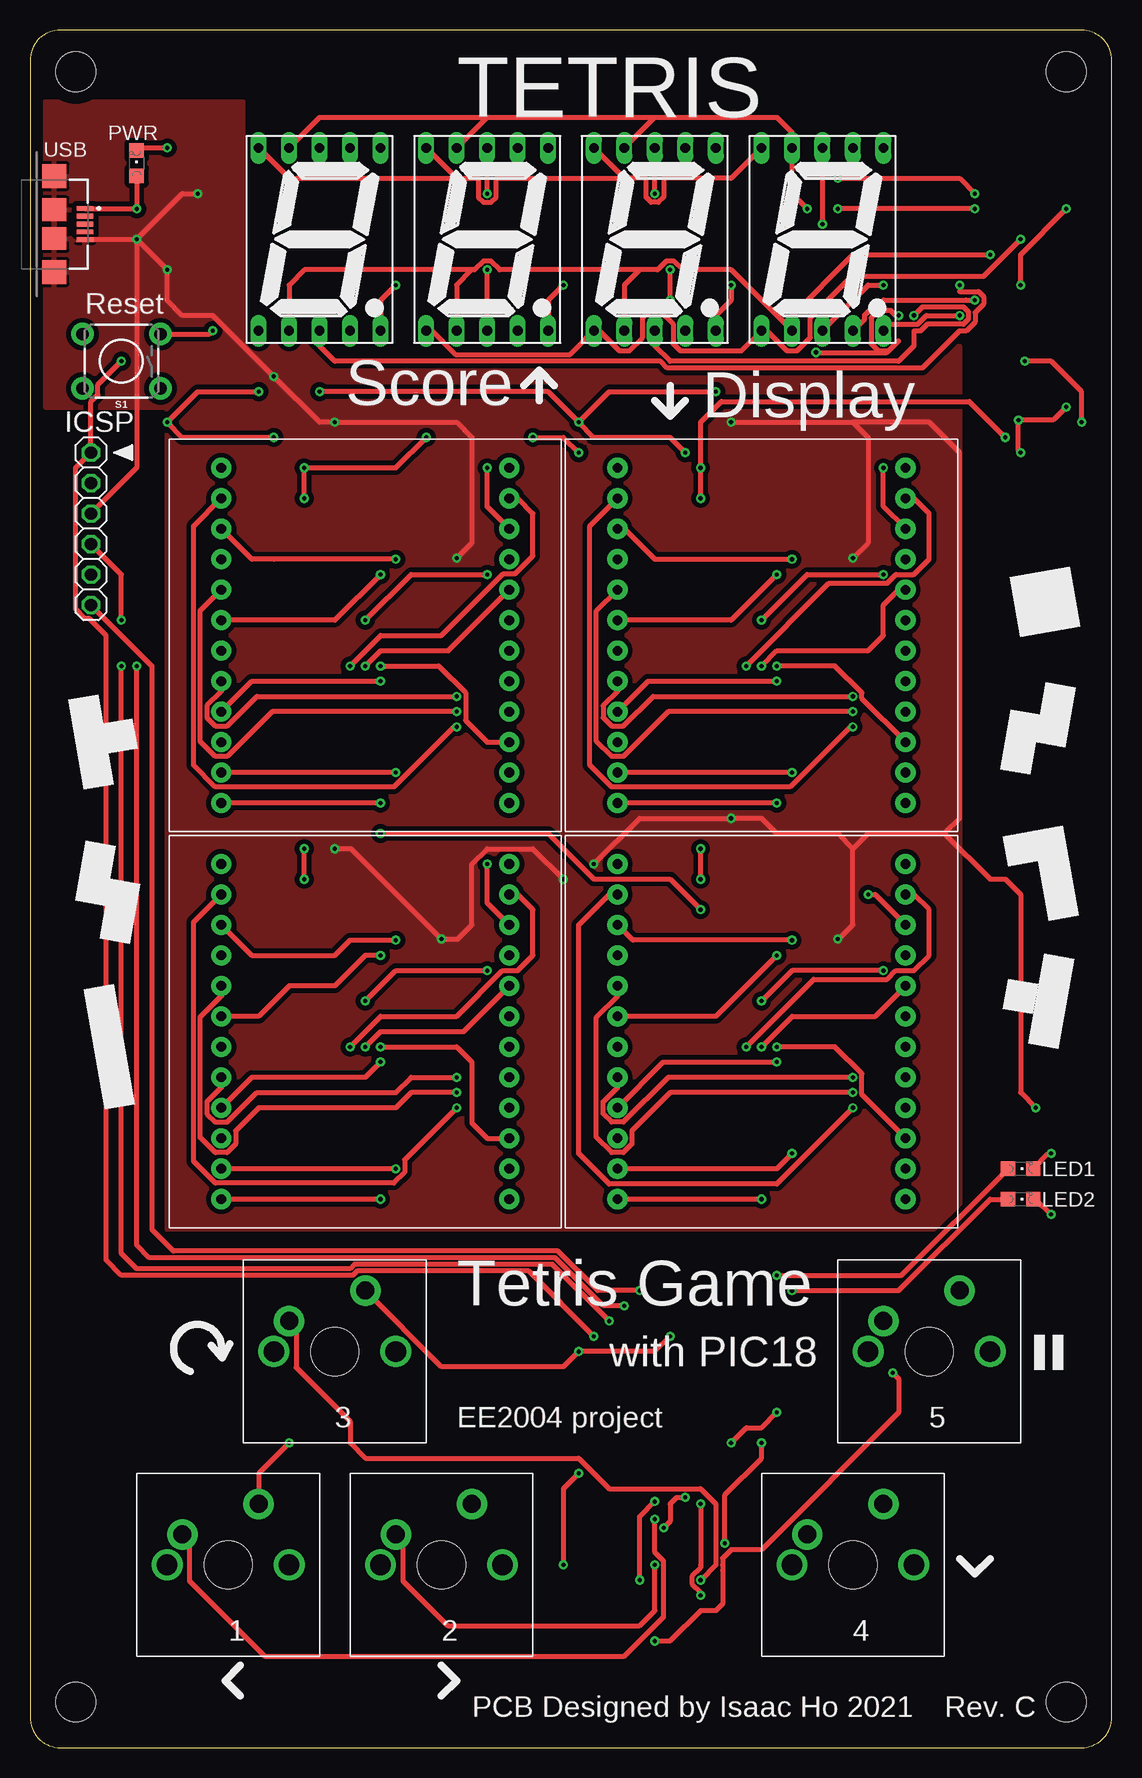
[diagram p2: board, top side]
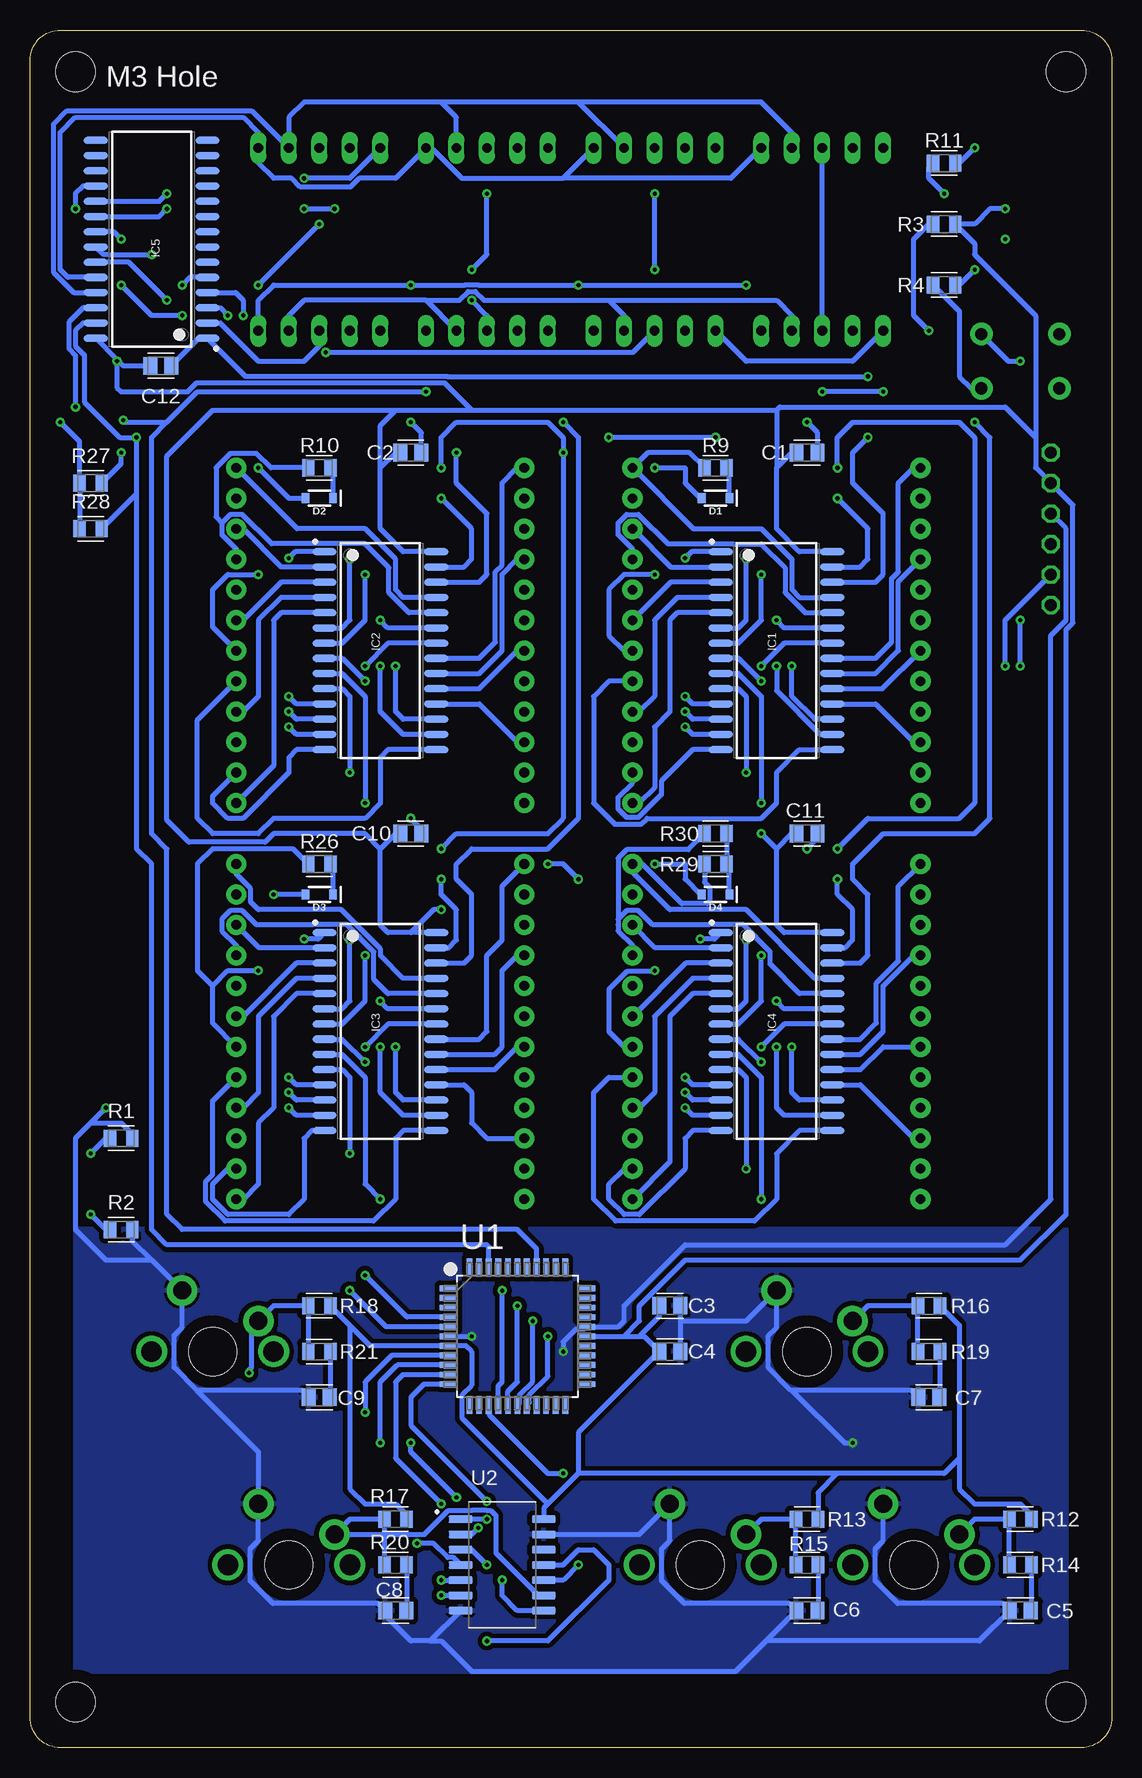
[diagram p3: board, bottom side, seen from below]

Size 90.15 x 143.18 mm. Coordinates in mm from the lower left corner, seen from the top.
Outline: 0,140.64 0,2.54 arc90 2.54,0 87.61,0 arc90 90.15,2.54 90.15,140.64 arc90 87.61,143.18 2.54,143.18 arc90 0,140.64
Copper layers (1*16): Top 0.035mm / dielectric 1.5mm / Bottom 0.035mm
Design rules "default": minimum track width 6mil, minimum drill 0.35mm, track to track 6mil, track to pad 6mil, pad to pad 6mil, via to via 6mil, smd to smd 6mil, copper to edge 40mil, drill to drill 6mil, minimum pad ring 10mil, minimum via ring 8mil, stop-mask expansion 4mil, vias tented up to drill 0mil, thermal gap 10mil
Holes 3.3 mm at 3.81,3.81 86.36,3.81 86.36,139.7 3.81,139.7

### Footprints (pad centres in the part's own frame; a part is rotated, then mirrored left to right if it is on the bottom)
CAPC2012X110 = smd 1.165 x 1.465: 1 -0.875,0; 2 0.875,0
SOD-323 = smd 0.63 x 0.83: A 1.15,0; C -1.15,0
7SEG-13 = drill 0.813 long: 1 -5.08,-7.62; 2 -2.54,-7.62; 3 0,-7.62; 4 2.54,-7.62; 5 5.08,-7.62; 6 5.08,7.62; 7 2.54,7.62; 8 0,7.62; 9 -2.54,7.62; 10 -5.08,7.62
SOIC127P1031X264-28N = smd 2.05 x 0.6: 1 -4.65,8.255; 2 -4.65,6.985; 3 -4.65,5.715; 4 -4.65,4.445; 5 -4.65,3.175; 6 -4.65,1.905; 7 -4.65,0.635; 8 -4.65,-0.635; 9 -4.65,-1.905; 10 -4.65,-3.175; 11 -4.65,-4.445; 12 -4.65,-5.715; 13 -4.65,-6.985; 14 -4.65,-8.255; 15 4.65,-8.255; 16 4.65,-6.985; 17 4.65,-5.715; 18 4.65,-4.445; 19 4.65,-3.175; 20 4.65,-1.905; 21 4.65,-0.635; 22 4.65,0.635; 23 4.65,1.905; 24 4.65,3.175; 25 4.65,4.445; 26 4.65,5.715; 27 4.65,6.985; 28 4.65,8.255
1X06 = drill 1.016 octagon: 1 -6.35,0; 2 -3.81,0; 3 -1.27,0; 4 1.27,0; 5 3.81,0; 6 6.35,0
CHIPLED_0805 = smd 1.2 x 1.2: A 0,-1.05; C 0,1.05
SEGMENT_BICOL_BL-M12A883XX = drill 0.8 pad 1.676: 1 -13.97,-12; 2 -11.43,-12; 3 -8.89,-12; 4 -6.35,-12; 5 -3.81,-12; 6 -1.27,-12; 7 1.27,-12; 8 3.81,-12; 9 6.35,-12; 10 8.89,-12; 11 11.43,-12; 12 13.97,-12; 13 13.97,12; 14 11.43,12; 15 8.89,12; 16 6.35,12; 17 3.81,12; 18 1.27,12; 19 -1.27,12; 20 -3.81,12; 21 -6.35,12; 22 -8.89,12; 23 -11.43,12; 24 -13.97,12
RESC2012X65 = smd 1.031 x 1.42: 1 -0.919,0; 2 0.919,0
TACTILE_SWITCH_PTH_6.0MM = drill 1.016 pad 1.88: 1 -3.251,2.261; 2 3.251,2.261; 3 -3.251,-2.261; 4 3.251,-2.261
CHERRY-MX = drill 1.714 pad 1.93: P$3 -5.08,0; P$4 5.08,0 | drill 1.5 pad 2.54: SW1 -3.81,2.54; SW2 2.54,5.08 | hole 4: 0,0
QFP80P1200X1200X120-44N = smd 1.473 x 0.483: 1 -5.74,3.988; 2 -5.74,3.2; 3 -5.74,2.388; 4 -5.74,1.6; 5 -5.74,0.787; 6 -5.74,0; 7 -5.74,-0.787; 8 -5.74,-1.6; 9 -5.74,-2.388; 10 -5.74,-3.2; 11 -5.74,-3.988; 23 5.74,-3.988; 24 5.74,-3.2; 25 5.74,-2.388; 26 5.74,-1.6; 27 5.74,-0.787; 28 5.74,0; 29 5.74,0.787; 30 5.74,1.6; 31 5.74,2.388; 32 5.74,3.2; 33 5.74,3.988 | smd 0.483 x 1.473: 12 -3.988,-5.74; 13 -3.2,-5.74; 14 -2.388,-5.74; 15 -1.6,-5.74; 16 -0.787,-5.74; 17 0,-5.74; 18 0.787,-5.74; 19 1.6,-5.74; 20 2.388,-5.74; 21 3.2,-5.74; 22 3.988,-5.74; 34 3.988,5.74; 35 3.2,5.74; 36 2.388,5.74; 37 1.6,5.74; 38 0.787,5.74; 39 0,5.74; 40 -0.787,5.74; 41 -1.6,5.74; 42 -2.388,5.74; 43 -3.2,5.74; 44 -3.988,5.74
SOP127P780X200-14N = smd 1.97 x 0.61: 1 -3.465,3.81; 2 -3.465,2.54; 3 -3.465,1.27; 4 -3.465,0; 5 -3.465,-1.27; 6 -3.465,-2.54; 7 -3.465,-3.81; 8 3.465,-3.81; 9 3.465,-2.54; 10 3.465,-1.27; 11 3.465,0; 12 3.465,1.27; 13 3.465,2.54; 14 3.465,3.81
GCT_USB3085-XX-X_REVD = smd 0.4 x 1.4: 1 -1.3,2.55; 2 -0.65,2.55; 3 0,2.55; 4 0.65,2.55; 5 1.3,2.55 | smd 2 x 2: 6 -4,0; 7 4,0 | smd 1.9 x 2: 8 1.2,0; 9 -1.2,0

### Placement (x,y rotation side)
C1  25.4,107.95 0 bottom
C2  58.42,107.95 0 bottom
C3  36.83,36.83 0 bottom
C4  36.83,33.02 0 bottom
C5  7.62,11.43 180 bottom
C6  25.4,11.43 180 bottom
C7  15.24,29.21 180 bottom
C8  59.69,11.43 180 bottom
C9  66.04,29.21 180 bottom
C10  58.42,76.2 0 bottom
C11  25.4,76.2 0 bottom
C12  79.25,115.19 0 bottom
D1  33.02,104.14 180 bottom
D2  66.04,104.14 180 bottom
D3  66.04,71.12 180 bottom
D4  33.02,71.12 180 bottom
D5  66.04,125.73 0 top
D6  52.07,125.73 0 top
D7  38.1,125.73 0 top
D8  24.13,125.73 0 top
IC1  27.94,91.44 0 bottom
IC2  60.96,91.44 0 bottom
IC3  60.96,59.69 0 bottom
IC4  27.94,59.69 0 bottom
IC5  80.01,125.73 180 bottom
ICSP  5.08,101.6 270 top
LED1  82.55,48.26 270 top
LED2  82.55,45.72 270 top
LED4  27.94,92.71 270 top
LED5  60.96,92.71 270 top
LED6  60.96,59.69 270 top
LED7  27.94,59.69 270 top
PWR  8.89,132.08 0 top
R1  82.55,50.8 0 bottom
R2  82.55,43.18 0 bottom
R3  13.97,127 180 bottom
R4  13.97,121.92 0 bottom
R9  33.02,106.68 180 bottom
R10  66.04,106.68 180 bottom
R11  13.97,132.08 0 bottom
R12  7.62,19.05 0 bottom
R13  25.4,19.05 180 bottom
R14  7.62,15.24 0 bottom
R15  25.4,15.24 180 bottom
R16  15.24,36.83 180 bottom
R17  59.69,19.05 0 bottom
R18  66.04,36.83 0 bottom
R19  15.24,33.02 180 bottom
R20  59.69,15.24 0 bottom
R21  66.04,33.02 0 bottom
R26  66.04,73.66 180 bottom
R27  85.09,105.41 0 bottom
R28  85.09,101.6 0 bottom
R29  33.02,73.66 180 bottom
R30  33.02,76.2 180 bottom
S1  7.62,115.57 180 top
SWITCH1  16.51,15.24 0 top
SWITCH2  34.29,15.24 0 top
SWITCH3  25.4,33.02 0 top
SWITCH4  68.58,15.24 0 top
SWITCH5  74.93,33.02 0 top
U1  49.53,34.29 0 bottom
U2  50.8,15.24 0 bottom
USB  2.03,127 270 top

### Tracks (layer width: path | path; a pad name or v marks a point on that pad's centre or on a via)
5D2  (via drill 0.35)
  Top 0.406: v65.5,116.3 71.41,116.3 72.39,117.28 71.54,116.43 70.7,116.43 70.1,117.03 70.1,119.19 70.7,119.79 71.74,119.79 72.14,119.38 v72.39,119.38 | D7.3 v38.1,123.19 | v38.1,129.54 D7.8
  Bottom 0.406: D7.3 39.91,116.3 v65.5,116.3 | IC5.4 73.03,121.28 72.39,120.65 v72.39,119.38 | v38.1,123.19 v38.1,129.54
5D3  (via drill 0.35)
  Top 0.406: D8.3 24.13,116.84 25.4,115.57 52.55,115.57 53.11,115.01 74.37,115.01 77.45,118.09 78,118.09 78.76,118.84 78.76,119.64 79.47,120.35 79.47,120.95 79.04,121.38 77.47,121.38 v77.47,121.92
  Bottom 0.406: IC5.5 76.84,122.56 v77.47,121.92 | D8.3 D8.8
5SA
  Bottom 0.406: D6.7 54.61,135.89 55.88,137.16 | 55.88,137.16 67.31,137.16 68.58,135.89 D5.7 71.68,136.45 87.07,136.45 88.19,135.33 88.19,122.96 86.52,121.28 IC5.25 | D7.7 44.45,137.16 | 44.45,137.16 55.88,137.16 | D8.7 26.67,134.62 29.21,137.16 44.45,137.16
5SB
  Bottom 0.406: 45.72,130.81 54.17,130.81 56.71,133.35 D6.6 59.69,130.81 62.71,130.81 63.44,130.08 67.61,130.08 68.35,130.81 69.85,130.81 71.12,132.08 D5.6 71.12,134.62 72.39,135.89 86.36,135.89 87.63,134.62 87.63,123.19 87,122.56 IC5.24 | 45.72,130.81 D7.6 | D8.6 31.75,130.81 45.72,130.81
5SC  (via drill 0.35)
  Top 0.406: D5.4 69.55,119.08 69.55,119.42 70.47,120.34 70.81,120.34 71.14,120.67 78,120.67 78.03,120.65 v78.74,120.65
  Bottom 0.406: D6.4 57.15,120.65 | D5.4 68.58,119.38 67.31,120.65 57.15,120.65 | 41.91,120.65 40.64,119.38 D7.4 | 41.91,120.65 27.94,120.65 26.67,119.38 D8.4 | 57.15,120.65 54.38,120.65 53.64,121.38 53.04,121.38 52.3,120.65 41.91,120.65 | v78.74,120.65 81.92,123.83 IC5.23
5SD  (via drill 0.35)
  Top 0.406: 50.8,123.19 49.53,121.92 D6.2 | 36.83,123.19 35.56,121.92 D7.2 | 36.83,123.19 22.86,123.19 21.59,121.92 D8.2 | v80.01,124.46 68.58,124.46 63.5,119.38 D5.2 58.42,123.19 54.38,123.19 53.64,123.92 53.04,123.92 52.3,123.19 50.8,123.19 | 50.8,123.19 39.14,123.19 38.4,123.92 37.8,123.92 37.06,123.19 36.83,123.19
  Bottom 0.406: IC5.22 84.05,124.48 83.66,124.48 83.64,124.46 v80.01,124.46
5SDP  (via drill 0.35)
  Top 0.406: v58.42,121.92 58.42,120.65 57.15,119.38 D6.5 | v44.45,121.92 43.18,120.65 D7.5 | v30.48,121.92 29.21,120.65 D8.5 | D5.5 71.66,118.65 73.96,118.65 74.7,119.38 v77.47,119.38 | v82.55,121.92 82.55,124.46 v86.36,128.27
  Bottom 0.406: D5.5 71.12,120.65 69.85,121.92 v58.42,121.92 53.9,121.92 53.88,121.94 52.8,121.94 52.78,121.92 v44.45,121.92 v30.48,121.92 | v77.47,119.38 80.01,119.38 v82.55,121.92 | IC5.18 85.73,130.17 86.36,129.54 v86.36,128.27
5SE  (via drill 0.35)
  Top 0.406: D7.1 33.46,118.11 35.44,116.13 45.01,116.13 D6.1 47.43,118.11 49.11,116.43 49.95,116.43 51.05,117.54 51.05,119.19 51.65,119.79 52.49,119.79 53.59,118.68 53.59,117.03 54.19,116.43 59.28,116.43 D5.1 61.4,118.11 63.08,116.43 63.92,116.43 65.02,117.54 65.02,119.19 68.49,122.65 79.47,122.65 v82.55,125.73
  Bottom 0.406: D8.1 21.59,115.57 30.48,115.57 D7.1 | v82.55,125.73 83.19,126.37 IC5.21
5SF  (via drill 0.35)
  Top 0.406: D6.9 52.07,135.89 | 52.07,135.89 62.23,135.89 63.5,134.62 D5.9 63.5,129.54 v64.77,128.27 | D7.9 38.1,135.89 | 38.1,135.89 52.07,135.89 | D8.9 24.13,135.89 38.1,135.89 | v78.74,128.27 v67.31,128.27
  Bottom 0.406: IC5.20 79.38,127.64 v78.74,128.27 | v67.31,128.27 v64.77,128.27
5SG  (via drill 0.35)
  Top 0.406: D5.10 58.42,130.81 52.8,130.81 52.8,129.24 52.37,128.81 51.77,128.81 51.34,129.24 51.34,130.81 49.53,130.81 | 49.53,130.81 D6.10 | D7.10 35.56,130.81 | D8.10 21.59,130.81 35.56,130.81 | 35.56,130.81 37.37,130.81 37.37,129.24 37.8,128.81 38.4,128.81 38.83,129.24 38.83,130.81 49.53,130.81 | v67.31,130.81 77.47,130.81 v78.74,129.54
  Bottom 0.406: D5.10 63.5,130.81 v67.31,130.81 | IC5.19 79.38,128.91 v78.74,129.54
GND  (via drill 0.35)
  Top 0.406: v35.56,99.16 36.83,100.43 36.83,109.22 35.56,110.49 v25.4,110.49 24.13,110.49 v20.32,114.3 15.24,119.38 12.7,119.38 11.43,120.65 v11.43,123.19 v8.89,125.73 | v68.58,99.16 69.85,100.43 69.85,109.22 68.58,110.49 | v58.42,110.49 68.58,110.49 | v25.4,74.93 26.77,74.93 v34.29,67.41 35.66,67.41 36.83,68.58 36.83,73.66 38.1,74.93 41.91,74.93 v44.45,72.39 | v67.31,67.41 67.41,67.41 68.58,68.58 68.58,74.93 | 68.58,74.93 67.31,76.2 62.23,76.2 60.96,77.47 v58.42,77.47 50.8,77.47 v46.99,73.66 | 68.58,74.93 69.85,76.2 76.2,76.2 | 76.2,76.2 77.47,77.47 77.47,107.95 74.93,110.49 68.58,110.49 | SWITCH1.SW2 19.05,22.86 v21.59,25.4 | SWITCH3.SW2 34.29,31.75 44.45,31.75 v45.72,33.02 52.07,33.02 v53.34,34.29 | USB.5 4.61,125.73 v8.89,125.73 | v8.89,125.73 8.89,106.68 ICSP.3 | v8.89,125.73 12.7,129.54 v13.97,129.54 | 76.2,76.2 80.01,72.39 81.28,72.39 82.55,71.12 82.55,54.61 v83.82,53.34
  Bottom 0.406: IC1.1 35.02,99.7 v35.56,99.16 | IC2.1 68.04,99.7 v68.58,99.16 | C2.2 57.55,109.62 v58.42,110.49 | C1.2 24.52,109.62 v25.4,110.49 | IC4.1 33.13,67.41 v34.29,67.41 | v25.4,74.93 24.52,75.8 C11.2 | IC3.1 66.15,67.41 v67.31,67.41 | v58.42,77.47 57.55,76.59 C10.2 | v44.45,72.39 45.72,73.66 v46.99,73.66 | C7.2 16.71,29.8 26.67,29.8 | 26.67,29.8 26.73,29.8 28.62,31.69 28.62,34.35 27.94,35.03 SWITCH3.SW2 30.48,35.56 35.96,35.56 | SWITCH1.SW2 19.05,17.25 19.73,16.57 19.73,13.91 17.84,12.02 9.09,12.02 C5.2 11.04,8.89 28.81,8.89 | 76.26,29.8 78.15,31.69 78.15,34.35 77.47,35.03 SWITCH5.SW2 80.01,40.64 | C9.2 67.51,29.8 76.26,29.8 | U2.7 56.8,8.89 | 56.8,8.89 58.42,8.89 60.57,11.04 C8.2 61.16,12.02 69.91,12.02 71.8,13.91 71.8,16.57 71.12,17.25 SWITCH4.SW2 71.12,24.66 76.26,29.8 | 28.81,8.89 C6.2 26.87,12.02 35.62,12.02 37.51,13.91 37.51,16.57 36.83,17.25 SWITCH2.SW2 39.37,17.78 U2.13 | 26.67,29.8 22.27,25.4 v21.59,25.4 | 56.8,8.89 55.88,8.89 53.34,6.35 31.36,6.35 28.81,8.89 | C3.2 35.96,35.56 | 35.96,35.56 C4.2 | R2.2 81.63,42.26 80.01,40.64 | R1.2 81.63,51.15 82.55,52.07 85.09,52.07 | 85.09,52.07 86.36,50.8 86.36,43.18 83.82,40.64 80.01,40.64 | v45.72,33.02 45.72,33.84 44.67,34.89 43.98,34.89 U1.29 41.12,35.08 40.64,35.56 40.64,36.83 35.56,41.91 8.89,41.91 5.08,45.72 5.08,92.71 3.81,93.98 3.81,101.6 ICSP.3 | U1.6 v53.34,34.29 | R4.2 12.7,121.92 v11.43,123.19 | v13.97,129.54 15.24,130.81 15.24,131.73 R11.1 | v83.82,53.34 85.09,52.07 | v20.32,114.3 55.37,114.3 55.39,114.32 72.21,114.32 IC5.1 76.09,117.48 C12.2
  pour Bottom (isolate 0.406): 3.81,43.18 86.36,43.18 86.36,6.35 3.81,6.35
  pour Top (isolate 0.406): 1.27,137.16 1.27,111.76 17.78,111.76 17.78,137.16
  pour Top (isolate 0.406): 11.43,116.84 77.47,116.84 77.47,43.18 11.43,43.18
MCLR  (via drill 0.35)
  Top 0.406: v46.99,34.29 41.55,39.73 27.27,39.73 26.91,39.37 7.62,39.37 6.35,40.64 6.35,92.71 4.93,94.13 4.62,94.13 3.81,94.94 3.81,106.68 ICSP.1 5.08,112.19 5.66,112.77 5.66,113.61 v7.62,115.57 | S1.3 14.96,117.83 v15.24,118.11
  Bottom 0.406: U1.18 48.53,28.77 48.53,29.43 46.99,30.97 v46.99,34.29 | S1.3 8.61,115.57 v7.62,115.57 | v15.24,118.11 16.51,119.38 16.51,125.73 15.24,127 R3.2
N$3
  Bottom 0.406: IC1.25 26.04,95.89 26.67,96.52 26.67,99.06 29.21,101.6 34.86,101.6 LED4.24 38.67,107.95 35.21,107.95 R9.2
N$4
  Bottom 0.406: LED4.21 39.94,99.91 41.13,101.11 41.13,102.09 40.43,102.79 39.45,102.79 37,100.35 31.59,100.35 31.57,100.33 29.21,100.33 27.23,98.35 27.23,96.29 25.55,94.62 IC1.24
N$5
  Bottom 0.406: R4.1 12.7,119.73 12.7,114.3 11.71,113.31 S1.1
N$6  (via drill 0.35)
  Top 0.406: v27.94,93.98 31.75,97.79 v38.1,97.79
  Bottom 0.406: IC1.23 27.3,93.34 v27.94,93.98 | v38.1,97.79 40.64,97.79 41.91,96.52 41.91,92.71 40.64,91.44 LED4.18
N$7  (via drill 0.35)
  Top 0.406: v29.21,90.17 34.06,90.17 36.29,87.93 36.29,85.63 38.1,83.82 LED4.15
  Bottom 0.406: IC1.22 27.3,92.08 v29.21,90.17
N$8
  Bottom 0.406: IC1.21 19.68,90.81 18.34,92.15 18.34,97.45 17.78,98.01 17.78,105.41 16.51,106.68 LED4.1
N$9
  Bottom 0.406: IC1.20 19.68,89.53 17.78,91.44 17.78,97.22 LED4.4
N$10
  Bottom 0.406: IC1.19 19.11,88.27 LED4.7
N$11
  Bottom 0.406: IC1.18 19.68,87 16.51,83.82 LED4.10
N$12  (via drill 0.35)
  Top 0.406: LED4.23 40.64,104.14 41.91,102.87 41.91,99.34 40.43,97.87 39.45,97.87 34.29,92.71 29.21,92.71 v26.67,90.17
  Bottom 0.406: IC1.17 24.76,85.73 26.67,87.63 v26.67,90.17
N$13  (via drill 0.35)
  Top 0.406: LED4.20 34.86,91.44 29.21,91.44 v27.94,90.17
  Bottom 0.406: v27.94,90.17 27.94,88.11 24.29,84.45 IC1.16
N$14
  Bottom 0.406: LED4.17 41.91,88.9 43.18,87.63 43.18,78.74 41.43,76.99 39.21,76.99 38.73,77.47 29.21,77.47 27.94,78.74 27.94,81.28 26.04,83.19 IC1.15
N$15
  Bottom 0.406: IC1.14 34.92,83.19 37.54,80.57 37.54,79.45 39.45,77.55 40.43,77.55 41.13,78.25 41.13,79.23 39.94,80.43 LED4.14
N$16  (via drill 0.35)
  Top 0.406: v35.56,85.09 35.33,85.09 30.32,80.09 15.45,80.09 13.63,81.9 13.63,97.79 13.63,98.13 13.63,101.83 LED4.2
  Bottom 0.406: IC1.13 34.92,84.45 v35.56,85.09
N$17  (via drill 0.35)
  Top 0.406: v35.56,86.36 20.17,86.36 16.43,82.63 15.45,82.63 14.19,83.88 14.19,94.77 LED4.5
  Bottom 0.406: IC1.12 34.92,85.73 v35.56,86.36
N$18  (via drill 0.35)
  Top 0.406: LED4.8 15.94,88.05 14.75,86.85 14.75,85.87 15.45,85.17 16.43,85.17 18.9,87.63 v35.56,87.63
  Bottom 0.406: IC1.11 34.92,87 v35.56,87.63
N$19  (via drill 0.35)
  Top 0.406: v30.48,81.28 LED4.11
  Bottom 0.406: IC1.10 31.11,88.27 30.48,87.63 v30.48,81.28
N$20  (via drill 0.35)
  Top 0.406: LED4.22 38.1,103.44 v38.1,106.68
  Bottom 0.406: LED4.22 36.77,98.42 IC1.2 | v38.1,106.68 35.56,106.68 35.56,105.41 34.29,104.14 D1.A
N$21
  Bottom 0.406: IC1.3 36.77,97.16 LED4.19
N$22
  Bottom 0.406: IC1.4 36.2,95.89 38.1,93.98 38.1,87.63 39.37,86.36 LED4.16
N$23
  Bottom 0.406: IC1.5 36.2,94.62 36.83,93.98 36.83,86.36 38.1,85.09 38.1,80.01 39.37,78.74 LED4.13
N$24  (via drill 0.35)
  Top 0.406: v30.48,99.06 20.32,99.06 18.48,99.06 LED4.3
  Bottom 0.406: IC1.6 31.11,93.34 30.48,93.98 v30.48,99.06
N$25  (via drill 0.35)
  Top 0.406: v29.21,97.79 25.4,93.98 LED4.6
  Bottom 0.406: IC1.7 31.11,92.08 29.21,93.98 v29.21,97.79
N$26  (via drill 0.35)
  Top 0.406: LED4.9 18.48,88.9 v29.21,88.9
  Bottom 0.406: v29.21,88.9 31.11,90.81 IC1.8
N$27  (via drill 0.35)
  Top 0.406: v29.21,78.74 LED4.12
  Bottom 0.406: IC1.9 31.11,89.53 29.21,87.63 v29.21,78.74
N$28
  Bottom 0.406: D1.C 31.87,106.45 R9.1
N$29
  Bottom 0.406: R21.2 65.12,29.25 C9.1
N$34
  Bottom 0.406: IC2.25 59.05,95.89 59.69,96.52 59.69,99.06 62.23,101.6 67.88,101.6 LED5.24
N$35
  Bottom 0.406: IC2.24 58.58,94.62 60.25,96.29 60.25,98.35 62.25,100.35 70.02,100.35 72.47,102.79 73.45,102.79 74.15,102.09 | 74.15,102.09 74.15,101.11 72.96,99.91 LED5.21 | R10.2 70.08,106.68 71.28,107.87 73.45,107.87 74.65,106.68 74.65,102.59 74.15,102.09
N$36  (via drill 0.35)
  Top 0.406: v60.96,93.98 64.77,97.79 v71.12,97.79
  Bottom 0.406: LED5.18 74.93,93.41 74.93,96.52 73.66,97.79 v71.12,97.79 | IC2.23 60.33,93.34 v60.96,93.98
N$37  (via drill 0.35)
  Top 0.406: LED5.15 69.31,87.47 69.31,87.93 67.08,90.17 v62.23,90.17
  Bottom 0.406: IC2.22 60.33,92.08 v62.23,90.17
N$38
  Bottom 0.406: IC2.21 52.71,90.81 51.36,92.15 51.36,98.02 50.8,98.58 50.8,105.41 49.53,106.68 LED5.1
N$39
  Bottom 0.406: IC2.20 52.71,89.53 50.8,91.44 50.8,97.79 49.53,99.06 LED5.4
N$40
  Bottom 0.406: IC2.19 52.71,88.27 49.53,91.44 LED5.7
N$41
  Bottom 0.406: IC2.18 52.71,87 49.53,83.82 LED5.10
N$42  (via drill 0.35)
  Top 0.406: v59.69,90.17 66.58,97.06 71.42,97.06 72.16,97.79 73.66,97.79 74.93,99.06 74.93,102.87 73.66,104.14 LED5.23
  Bottom 0.406: IC2.17 59.05,85.73 59.69,86.36 v59.69,90.17
N$43  (via drill 0.35)
  Top 0.406: v60.96,90.17 62.23,91.44 69.85,91.44 71.12,92.71 71.12,95.25 72.39,96.52 LED5.20
  Bottom 0.406: IC2.16 59.05,84.45 60.96,86.36 v60.96,90.17
N$44
  Bottom 0.406: IC2.15 60.33,83.19 60.96,82.55 60.96,78.74 62.23,77.47 69.85,77.47 71.12,76.2 74.93,76.2 76.2,77.47 76.2,85.66 LED5.17
N$45
  Bottom 0.406: IC2.14 67.95,83.19 68.58,82.55 68.58,81.28 72.39,77.47 73.66,77.47 74.93,78.74 74.93,79.31 LED5.14
N$46  (via drill 0.35)
  Top 0.406: v68.58,85.09 68.35,85.09 63.34,80.09 48.47,80.09 46.65,81.9 46.65,101.83 LED5.2
  Bottom 0.406: IC2.13 67.95,84.45 v68.58,85.09
N$47  (via drill 0.35)
  Top 0.406: v68.58,86.36 53.19,86.36 49.45,82.63 48.47,82.63 47.21,83.88 47.21,94.77 LED5.5
  Bottom 0.406: IC2.12 67.95,85.73 v68.58,86.36
N$48  (via drill 0.35)
  Top 0.406: LED5.8 48.96,88.05 47.77,86.85 47.77,85.87 48.47,85.17 49.45,85.17 51.92,87.63 v68.58,87.63
  Bottom 0.406: IC2.11 67.95,87 v68.58,87.63
N$49  (via drill 0.35)
  Top 0.406: v63.5,81.28 LED5.11
  Bottom 0.406: IC2.10 64.14,88.27 63.5,87.63 v63.5,81.28
N$50  (via drill 0.35)
  Top 0.406: LED5.22 71.12,103.44 v71.12,106.68
  Bottom 0.406: IC2.2 69.22,98.42 72.39,101.6 LED5.22 | v71.12,106.68 68.58,104.14 D2.A
N$51
  Bottom 0.406: IC2.3 69.22,97.16 72.39,93.98 LED5.19
N$52
  Bottom 0.406: IC2.4 69.22,95.89 71.12,93.98 71.12,87.63 72.39,86.36 LED5.16
N$53  (via drill 0.35)
  Top 0.406: LED1.C 84.87,49.53 v85.09,49.53
  Bottom 0.406: R1.1 83.82,50.8 v85.09,49.53
N$54  (via drill 0.35)
  Top 0.406: PWR.C 9.11,133.35 v11.43,133.35
  Bottom 0.406: R11.2 12.7,132.08 v11.43,133.35
N$55
  Bottom 0.406: IC2.5 69.22,94.62 69.85,93.98 69.85,81.85 LED5.13
N$56  (via drill 0.35)
  Top 0.406: LED5.3 49.53,101.6 52.07,99.06 v63.5,99.06
  Bottom 0.406: IC2.6 64.14,93.34 63.5,93.98 v63.5,99.06
N$57  (via drill 0.35)
  Top 0.406: v62.23,97.79 58.42,93.98 LED5.6
  Bottom 0.406: IC2.7 64.14,92.08 62.23,93.98 v62.23,97.79
N$58  (via drill 0.35)
  Top 0.406: LED5.9 51.5,88.9 v62.23,88.9
  Bottom 0.406: IC2.8 64.14,90.81 v62.23,88.9
N$59  (via drill 0.35)
  Top 0.406: LED2.C 83.82,45.72 v85.09,44.45
  Bottom 0.406: v85.09,44.45 83.82,43.18 R2.1
N$60
  Bottom 0.406: R14.2 6.7,11.47 C5.1
N$61
  Bottom 0.406: R15.1 24.48,11.47 C6.1
N$62
  Bottom 0.406: R20.2 58.77,11.47 C8.1
N$63
  Bottom 0.406: R19.1 14.32,29.25 C7.1
N$64  (via drill 0.35)
  Top 0.406: v62.23,78.74 LED5.12
  Bottom 0.406: IC2.9 64.14,89.53 62.23,87.63 v62.23,78.74
N$67
  Bottom 0.406: D2.C 64.89,106.45 R10.1
N$72
  Bottom 0.406: IC4.24 26.04,62.86 28.48,65.31 28.48,66.34 30.73,68.6 33.59,68.6 33.61,68.58 38.25,68.58 39.45,69.77 40.43,69.77 41.13,69.07 | LED7.21 39.94,66.89 41.13,68.09 41.13,68.58 41.13,69.07 | R30.2 35.29,74.85 40.43,74.85 41.13,74.15 41.13,69.07
N$73  (via drill 0.35)
  Top 0.406: v27.94,62.23 30.48,64.77 v38.1,64.77
  Bottom 0.406: IC4.23 27.3,61.59 v27.94,62.23 | v38.1,64.77 38.18,64.69 40.43,64.69 41.91,63.22 41.91,59.69 40.64,58.42 LED7.18
N$74  (via drill 0.35)
  Top 0.406: v29.21,58.42 35.56,58.42 36.83,57.15 36.83,52.07 38.1,50.8 LED7.15
  Bottom 0.406: v29.21,58.42 27.3,60.33 IC4.22
N$75
  Bottom 0.406: IC4.21 20.95,59.05 19.61,60.4 19.61,63.73 17.78,65.56 17.78,71.82 LED7.1
N$76
  Bottom 0.406: IC4.20 20.95,57.78 19.05,59.69 19.05,63.5 16.51,66.04 LED7.4
N$77
  Bottom 0.406: IC4.19 20.95,56.52 19.05,58.42 LED7.7
N$78
  Bottom 0.406: IC4.18 20.95,55.25 16.51,50.8 LED7.10
N$79  (via drill 0.35)
  Top 0.406: v26.67,58.42 29.21,60.96 35.56,60.96 39.37,64.77 40.64,64.77 41.91,66.04 41.91,69.85 40.64,71.12 LED7.23
  Bottom 0.406: IC4.17 26.04,53.97 26.67,54.61 v26.67,58.42
N$80  (via drill 0.35)
  Top 0.406: v27.94,58.42 29.21,59.69 36.13,59.69 LED7.20
  Bottom 0.406: IC4.16 27.3,52.7 27.94,53.34 v27.94,58.42
N$81
  Bottom 0.406: IC4.15 26.04,51.44 27.94,49.53 27.94,45.72 29.77,43.89 41.35,43.89 43.18,45.72 43.18,54.61 41.91,55.88 LED7.17
N$82
  Bottom 0.406: IC4.14 34.92,51.44 35.56,50.8 35.56,48.26 39.37,44.45 40.64,44.45 41.91,45.72 41.91,46.99 40.64,48.26 LED7.14
N$83  (via drill 0.35)
  Top 0.406: v35.56,53.34 31.21,48.99 31.21,47.96 30.32,47.07 15.45,47.07 13.63,48.88 13.63,68.81 LED7.2
  Bottom 0.406: IC4.13 34.92,52.7 v35.56,53.34
N$84  (via drill 0.35)
  Top 0.406: v35.56,54.61 31.75,54.61 30.48,53.34 19.05,53.34 17.13,51.42 17.13,50.31 16.43,49.61 15.45,49.61 14.19,50.86 14.19,60.9 15.94,62.65 LED7.5
  Bottom 0.406: IC4.12 34.92,53.97 v35.56,54.61
N$85  (via drill 0.35)
  Top 0.406: LED7.8 15.94,55.03 14.75,53.83 14.75,52.85 15.45,52.15 16.43,52.15 18.9,54.61 19.05,54.61 30.48,54.61 31.75,55.88 v35.56,55.88
  Bottom 0.406: IC4.11 34.92,55.25 v35.56,55.88
N$86  (via drill 0.35)
  Top 0.406: v30.48,48.26 LED7.11
  Bottom 0.406: IC4.10 31.11,56.52 30.48,55.88 v30.48,48.26
N$87  (via drill 0.35)
  Top 0.406: LED7.22 38.1,70.42 v38.1,73.66
  Bottom 0.406: IC4.2 38.04,66.67 LED7.22 | v38.1,73.66 35.56,73.66 35.56,72.39 34.29,71.12 D4.A
N$88
  Bottom 0.406: IC4.3 35.49,65.41 LED7.19
N$89
  Bottom 0.406: IC4.4 34.92,64.14 38.1,60.96 38.1,54.61 39.37,53.34 LED7.16
N$90
  Bottom 0.406: IC4.5 34.92,62.86 36.83,60.96 36.83,48.83 LED7.13
N$91  (via drill 0.35)
  Top 0.406: LED7.3 18.48,66.04 25.4,66.04 26.67,67.31 v30.48,67.31
  Bottom 0.406: IC4.6 31.11,61.59 30.48,62.23 v30.48,67.31
N$92  (via drill 0.35)
  Top 0.406: v29.21,66.04 27.94,66.04 25.4,63.5 21.59,63.5 19.05,60.96 LED7.6
  Bottom 0.406: IC4.7 31.11,60.33 29.21,62.23 v29.21,66.04
N$93  (via drill 0.35)
  Top 0.406: v29.21,57.15 27.94,55.88 18.48,55.88 LED7.9
  Bottom 0.406: IC4.8 31.11,59.05 v29.21,57.15
N$94  (via drill 0.35)
  Top 0.406: v29.21,45.72 LED7.12
  Bottom 0.406: IC4.9 31.11,57.78 29.21,55.88 v29.21,45.72
N$97
  Bottom 0.406: D4.C 31.87,73.43 R29.1 R30.1
N$98
  Bottom 0.406: IC4.25 24.76,64.14 30.48,69.85 36.83,69.85 39.94,72.96 LED7.24 39.14,73.66 35.83,70.35 33.71,70.35 33.5,70.56 33.5,71.68 33.94,72.12 R29.2
N$101
  Bottom 0.406: IC3.25 59.05,64.14 60.94,66.02 60.94,66.58 64.21,69.85 71.12,69.85 71.77,70.5 71.77,71.61 72.96,72.81 LED6.24
N$102
  Bottom 0.406: IC3.24 60.33,62.86 61.5,64.04 61.5,66.34 63.75,68.6 66.61,68.6 66.63,68.58 71.27,68.58 72.47,69.77 73.45,69.77 74.15,69.07 74.15,68.09 72.96,66.89 LED6.21
N$103  (via drill 0.35)
  Top 0.406: v60.96,62.23 63.5,64.77 v71.12,64.77
  Bottom 0.406: IC3.23 60.33,61.59 v60.96,62.23 | LED6.18 74.93,60.39 74.93,63.5 | 74.93,63.5 73.66,64.77 v71.12,64.77 | R26.2 68.23,74.93 74.93,74.93 76.2,73.66 76.2,64.77 74.93,63.5
N$104  (via drill 0.35)
  Top 0.406: LED6.15 69.31,54.45 69.31,56.18 67.08,58.42 v62.23,58.42
  Bottom 0.406: IC3.22 60.33,60.33 v62.23,58.42
N$105
  Bottom 0.406: IC3.21 52.71,59.05 52.07,59.69 52.07,66.04 50.8,67.31 50.8,71.82 LED6.1
N$106
  Bottom 0.406: IC3.20 51.44,57.78 50.8,58.42 50.8,64.77 49.53,66.04 LED6.4
N$107
  Bottom 0.406: IC3.19 51.44,56.52 49.53,58.42 LED6.7
N$108
  Bottom 0.406: IC3.18 53.98,55.25 53.34,54.61 53.34,52.07 52.07,50.8 LED6.10
N$109  (via drill 0.35)
  Top 0.406: v59.69,58.42 65.31,64.04 71.42,64.04 72.16,64.77 73.66,64.77 74.93,66.04 74.93,69.85 73.66,71.12 LED6.23
  Bottom 0.406: IC3.17 59.05,53.97 59.69,54.61 v59.69,58.42
N$110  (via drill 0.35)
  Top 0.406: v60.96,58.42 63.5,60.96 70.42,60.96 LED6.20
  Bottom 0.406: IC3.16 59.05,52.7 60.96,54.61 v60.96,58.42
N$111
  Bottom 0.406: IC3.15 59.05,51.44 59.69,50.8 59.69,45.72 61.52,43.89 73.89,43.89 75.49,45.49 75.49,47.22 74.93,47.78 74.93,53.91 LED6.17
N$112
  Bottom 0.406: IC3.14 66.67,51.44 67.31,50.8 67.31,45.72 68.58,44.45 73.66,44.45 74.93,45.72 74.93,46.99 73.66,48.26 LED6.14
N$113  (via drill 0.35)
  Top 0.406: v68.58,53.34 62.23,46.99 48.26,46.99 45.72,49.53 45.72,68.58 48.26,71.12 LED6.2
  Bottom 0.406: IC3.13 67.95,52.7 v68.58,53.34
N$114  (via drill 0.35)
  Top 0.406: v68.58,54.61 53.34,54.61 50.15,51.42 50.15,50.31 49.45,49.61 48.47,49.61 47.21,50.86 47.21,60.9 48.96,62.65 LED6.5
  Bottom 0.406: IC3.12 67.95,53.97 v68.58,54.61
N$115  (via drill 0.35)
  Top 0.406: LED6.8 48.96,55.03 47.77,53.83 47.77,52.85 48.47,52.15 49.45,52.15 53.19,55.88 v68.58,55.88
  Bottom 0.406: IC3.11 67.95,55.25 v68.58,55.88
N$116  (via drill 0.35)
  Top 0.406: v63.5,49.53 62.23,48.26 LED6.11
  Bottom 0.406: IC3.10 64.14,56.52 63.5,55.88 v63.5,49.53
N$117  (via drill 0.35)
  Top 0.406: v69.85,71.12 70.42,71.12 LED6.22
  Bottom 0.406: IC3.2 71.06,66.67 LED6.22 | D3.A v69.85,71.12
N$118
  Bottom 0.406: IC3.3 67.95,65.41 72.39,60.96 LED6.19
N$119
  Bottom 0.406: IC3.4 67.95,64.14 71.12,60.96 71.12,54.61 72.39,53.34 LED6.16
N$120
  Bottom 0.406: IC3.5 67.95,62.86 69.85,60.96 69.85,53.34 71.12,52.07 71.12,46.99 72.39,45.72 LED6.13
N$121  (via drill 0.35)
  Top 0.406: LED6.3 50.23,67.31 v63.5,67.31
  Bottom 0.406: IC3.6 64.14,61.59 63.5,62.23 v63.5,67.31
N$122  (via drill 0.35)
  Top 0.406: v62.23,66.04 57.15,60.96 LED6.6
  Bottom 0.406: IC3.7 64.14,60.33 62.23,62.23 v62.23,66.04
N$123  (via drill 0.35)
  Top 0.406: LED6.9 52.77,57.15 v62.23,57.15
  Bottom 0.406: IC3.8 64.14,59.05 v62.23,57.15
N$124  (via drill 0.35)
  Top 0.406: v60.96,45.72 LED6.12
  Bottom 0.406: IC3.9 64.14,57.78 62.23,55.88 62.23,46.99 v60.96,45.72
N$127
  Bottom 0.406: D3.C 64.89,73.43 R26.1
N$131  (via drill 0.35)
  Top 0.406: D5.8 v66.04,127 | D5.3 69.85,121.92 v71.12,121.92
  Bottom 0.406: IC5.2 74.3,118.75 71.12,115.57 67.31,115.57 66.04,116.84 D5.3 | v71.12,121.92 v66.04,127
N$132  (via drill 0.35)
  Top 0.406: D6.3 52.07,116.84 53.34,115.57 72.39,115.57 73.66,116.84 73.66,118.09 74.2,118.09 74.75,118.65 77.77,118.65 78.2,119.08 78.2,119.68 77.77,120.11 74.39,120.11 v73.66,119.38 | v53.34,120.65 v53.34,123.19 | v52.07,129.54 D6.8
  Bottom 0.406: IC5.3 74.3,120.02 v73.66,119.38 | D6.3 52.07,119.38 v53.34,120.65 | v53.34,123.19 52.07,124.46 v52.07,129.54
PGC  (via drill 0.35)
  Top 0.406: v49.53,36.83 47.78,36.83 43.77,40.84 9.96,40.84 8.89,41.91 v8.89,90.17
  Bottom 0.406: U1.16 50.32,29.69 49.53,30.48 v49.53,36.83 | ICSP.5 8.89,93.98 v8.89,90.17
PGD  (via drill 0.35)
  Top 0.406: v48.26,35.56 43.54,40.28 27.04,40.28 26.68,39.93 8.89,39.93 7.62,41.2 v7.62,90.17 | v7.62,93.98 7.62,97.79 ICSP.4
  Bottom 0.406: U1.17 49.34,28.74 49.34,29.43 48.26,30.51 v48.26,35.56 | v7.62,90.17 v7.62,93.98
PGM  (via drill 0.35)
  Top 0.406: v50.8,38.1 47.3,38.1 44,41.4 11.94,41.4 10.16,43.18 10.16,90.17 ICSP.6
  Bottom 0.406: U1.15 51.13,30.15 50.8,30.48 v50.8,38.1
RB0  (via drill 0.35)
  Top 0.406: v54.61,20.86 53.88,20.86 53.34,20.32 53.34,18.85 v52.8,18.32 | v58.42,25.4 59.69,26.67 60.96,26.67 v62.23,27.94
  Bottom 0.406: U1.8 60.02,32.69 62.23,30.48 v62.23,27.94 | v54.61,20.86 58.42,24.67 v58.42,25.4 | v52.8,18.32 53.34,17.78 U2.2
RB1  (via drill 0.35)
  Top 0.406: v57.9,17.03 57.9,21.07 60.96,24.13 v60.96,25.4
  Bottom 0.406: U1.9 59.54,31.9 60.96,30.48 v60.96,25.4 | U2.4 54.87,15.85 55.35,15.85 56.53,17.03 v57.9,17.03
RB2  (via drill 0.35)
  Top 0.406: v55.88,12.7 55.88,12.93 55.15,13.67 55.15,14.27 55.88,15.01 55.88,15.24 v55.88,20.32
  Bottom 0.406: U1.10 59.08,31.09 59.69,30.48 59.69,24.13 v55.88,20.32 | v55.88,12.7 U2.6
RB3  (via drill 0.35)
  Top 0.406: v52.07,20.52 50.8,19.25 v50.8,13.97
  Bottom 0.406: U1.11 57.33,30.3 58.42,29.21 58.42,26.87 v52.07,20.52 | U2.8 49.53,11.43 50.8,12.7 v50.8,13.97
RB4  (via drill 0.35)
  Top 0.406: v45.72,22.86 44.45,21.59 v44.45,15.24
  Bottom 0.406: U1.14 51.92,27.79 46.99,22.86 v45.72,22.86 | v44.45,15.24 45.72,13.97 U2.10
RD6  (via drill 0.35)
  Top 0.406: LED1.A 72.61,39.37 v62.23,39.37
  Bottom 0.406: U1.4 58.75,35.89 v62.23,39.37
RD7  (via drill 0.35)
  Top 0.406: v63.5,38.1 72.39,38.1 80.01,45.72 LED2.A
  Bottom 0.406: U1.5 60.48,35.08 v63.5,38.1
SCK  (via drill 0.35)
  Top 0.406: v20.32,109.22 12.7,109.22 v11.43,110.49 13.97,113.03 v19.05,113.03 | v54.61,107.95 53.34,109.22 46.99,109.22 v45.72,110.49 | v45.72,110.49 43.18,113.03 v24.13,113.03 | v45.72,110.49 48.26,113.03 v57.15,113.03 | v86.36,111.76 85.27,110.67 v82.38,110.67 82.38,108.12 v82.55,107.95
  Bottom 0.406: IC1.26 19.68,97.16 19.05,97.79 19.05,102.87 21.59,105.41 21.59,107.95 v20.32,109.22 | IC2.26 52.71,97.16 52.07,97.79 52.07,102.87 54.61,105.41 v54.61,107.95 | IC4.26 20.95,65.41 20.32,66.04 20.32,71.12 21.59,72.39 21.59,73.66 19.05,76.2 11.43,76.2 10.16,77.47 10.16,109.22 v11.43,110.49 | IC3.26 53.98,65.41 53.34,66.04 53.34,71.12 54.61,72.39 54.61,73.66 53.34,74.93 46.99,74.93 44.45,77.47 44.45,109.22 v45.72,110.49 | U1.37 47.93,41.58 49.53,43.18 77.47,43.18 78.74,44.45 78.74,74.93 80.01,76.2 80.01,109.22 78.74,110.49 | v19.05,113.03 v24.13,113.03 | 78.74,110.49 76.2,113.03 v57.15,113.03 | v82.38,110.67 82.2,110.49 78.74,110.49 | IC5.26 85.73,120.02 86.92,118.82 86.92,116.61 86.36,116.05 v86.36,111.76 | R27.2 82.55,107.03 v82.55,107.95
SDA  (via drill 0.35)
  Top 0.406: v22.86,104.14 v22.86,106.68 30.48,106.68 v33.02,109.22 | v55.88,104.14 v55.88,106.68 55.88,110.49 57.61,112.22 78.28,112.22 v81.28,109.22 | v22.86,72.39 v22.86,74.93 | v55.88,72.39 v55.88,74.93 | v41.91,109.22 44.45,109.22 v45.72,107.95
  Bottom 0.406: IC1.27 20.95,98.42 20.32,99.06 20.32,101.6 v22.86,104.14 | v22.86,106.68 22.86,109.22 21.59,110.49 12.7,110.49 11.43,109.22 11.43,78.74 12.7,77.47 20.32,77.47 v22.86,74.93 | IC2.27 53.98,98.42 53.34,99.06 53.34,101.6 v55.88,104.14 | v55.88,106.68 55.88,109.22 54.61,110.49 46.99,110.49 45.72,109.22 v45.72,107.95 45.72,77.47 46.99,76.2 54.61,76.2 v55.88,74.93 | IC4.27 22.22,66.67 21.59,67.31 21.59,69.85 22.86,71.12 v22.86,72.39 | IC3.27 55.25,66.67 54.61,67.31 54.61,69.85 55.88,71.12 v55.88,72.39 | U1.42 51.92,41.76 52.07,41.91 78.74,41.91 80.01,43.18 80.01,73.66 81.28,74.93 81.28,104.49 | 81.28,104.49 v81.28,109.22 82.66,109.22 85.61,112.17 85.61,116.09 86.36,116.84 86.36,118.11 85.73,118.75 IC5.27 | v33.02,109.22 v41.91,109.22 | R28.2 81.28,104.49
SW1  (via drill 0.35)
  Top 0.406: SWITCH1.SW1 13.29,17.19 13.29,13.91 19.58,7.62 49.53,7.62 52.8,10.89 52.8,15.54 52.07,16.28 v52.07,19.05
  Bottom 0.406: SWITCH1.SW1 11.43,19.05 R12.1 R14.1 | v52.07,19.05 U2.1
SW2  (via drill 0.35)
  Top 0.406: SWITCH2.SW1 31.07,17.19 31.07,13.91 34.82,10.16 50.8,10.16 52.07,11.43 v52.07,15.24
  Bottom 0.406: R13.2 26.67,19.05 | 26.67,19.05 29.21,19.05 SWITCH2.SW1 | R15.2 26.32,18.7 26.67,19.05 | v52.07,15.24 53.34,16.51 U2.3
SW3  (via drill 0.35)
  Top 0.406: SWITCH3.SW1 22.18,34.97 22.18,31.69 26.67,27.2 26.67,25.4 27.94,24.13 45.72,24.13 48.26,21.59 55.88,21.59 57.15,20.32 57.15,15.24 v55.88,13.97
  Bottom 0.406: SWITCH3.SW1 20.32,36.83 R16.2 R19.2 | v55.88,13.97 U2.5
SW4
  Bottom 0.406: R20.1 R17.1 63.5,19.05 SWITCH4.SW1 57.28,17.78 55.28,19.78 53.34,19.78 52.07,19.78 51.77,19.78 51.34,19.35 51.34,16.22 47.81,12.7 U2.9
SW5  (via drill 0.35)
  Top 0.406: v71.89,31.25 72.39,30.76 72.39,27.94 60.96,16.51 58.42,16.51 57.71,15.8 57.71,15.24 57.71,14.76 57.71,11.99 57.15,11.43 55.88,11.43 53.34,8.89 v52.07,8.89
  Bottom 0.406: R21.1 R18.1 69.85,36.83 SWITCH5.SW1 71.71,34.97 71.71,31.69 71.89,31.5 v71.89,31.25 | v52.07,8.89 46.99,8.89 41.91,13.97 41.91,15.24 43.18,16.51 44.45,16.51 45.72,15.24 U2.11
VDD  (via drill 0.35)
  Top 0.406: v29.21,76.2 43.18,76.2 46.99,72.39 53.34,72.39 v55.88,69.85 | PWR.A 8.89,128.33 8.86,128.3 | USB.1 8.86,128.3 | 8.86,128.3 v8.89,128.27 | v87.63,110.49 87.63,113.03 85.09,115.57 v82.9,115.57
  Bottom 0.406: U1.28 40.64,34.29 | 40.64,34.29 39.37,34.29 | 39.37,34.29 38.98,34.29 C4.1 44.45,26.27 44.45,22.86 | 39.37,34.29 37.71,35.95 C3.1 | 40.64,34.29 39.37,35.56 39.37,36.83 35.56,40.64 7.62,40.64 3.81,44.45 3.81,93.19 3.25,93.75 3.25,103.58 ICSP.2 6.35,106.68 6.35,109.22 | IC1.28 26.04,99.7 27.94,101.6 27.94,104.14 27.94,106.68 | 27.94,106.68 26.67,107.95 C1.1 | IC2.28 59.05,99.7 60.96,101.6 60.96,106.68 | 60.96,106.68 59.69,107.95 C2.1 | IC4.28 27.3,67.94 27.94,68.58 27.94,74.93 | 27.94,74.93 26.67,76.2 C11.1 | IC3.28 58.42,67.94 | 58.42,67.94 60.33,67.94 60.96,68.58 60.96,74.93 | 60.96,74.93 59.69,76.2 C10.1 | 60.96,74.93 62.23,76.2 69.85,76.2 70.56,75.49 76.91,75.49 78.74,77.32 78.74,107.67 74.93,111.48 59.69,111.48 | 27.94,111.48 27.94,106.68 | 59.69,111.48 60.96,110.21 60.96,106.68 | 59.69,111.48 53.34,111.48 | 53.34,111.48 27.94,111.48 | 27.94,74.93 v29.21,76.2 | v55.88,69.85 56.52,69.85 58.42,67.94 | R18.2 63.5,35.21 | R17.2 58.77,19.4 59.69,20.32 62.23,20.32 63.5,21.59 63.5,35.21 | R16.1 12.7,35.21 12.7,24.13 | R12.2 6.7,19.4 7.62,20.32 11.43,20.32 12.7,21.59 12.7,24.13 | 12.7,24.13 13.97,22.86 22.86,22.86 | 22.86,22.86 24.48,21.24 R13.1 | 22.86,22.86 44.45,22.86 | 44.45,22.86 46.99,20.32 | 46.99,20.32 47.34,19.98 U2.14 | 46.99,20.32 54.12,27.45 54.12,29.43 53.34,30.21 53.34,33.02 53.82,33.5 U1.7 61.79,33.5 63.5,35.21 | v8.89,128.27 10.16,128.27 11.43,127 R3.1 11.43,125.38 11.43,124.46 6.35,119.38 6.35,109.22 | 27.94,111.48 27.66,111.76 8.89,111.76 6.35,109.22 | 53.34,111.48 55.62,113.76 76.26,113.76 76.99,113.03 82.55,113.03 82.9,113.38 v82.9,115.57 82.9,115.72 | IC5.28 82.9,115.72
  Bottom 0.406: 82.9,115.72 82.37,115.19 C12.1 | R28.1 R27.1 86.01,108.87 v87.63,110.49

### Text on the board
tNames: TETRIS | Reset | Score | Display | Tetris Game | with PIC18 | 3 | EE2004 project | 5 | 1 | 2 | 4 | PCB Designed by Isaac Ho 2021 | Rev. C
bNames: M3 Hole